# Altium project 701C USB Hub.PrjPCB
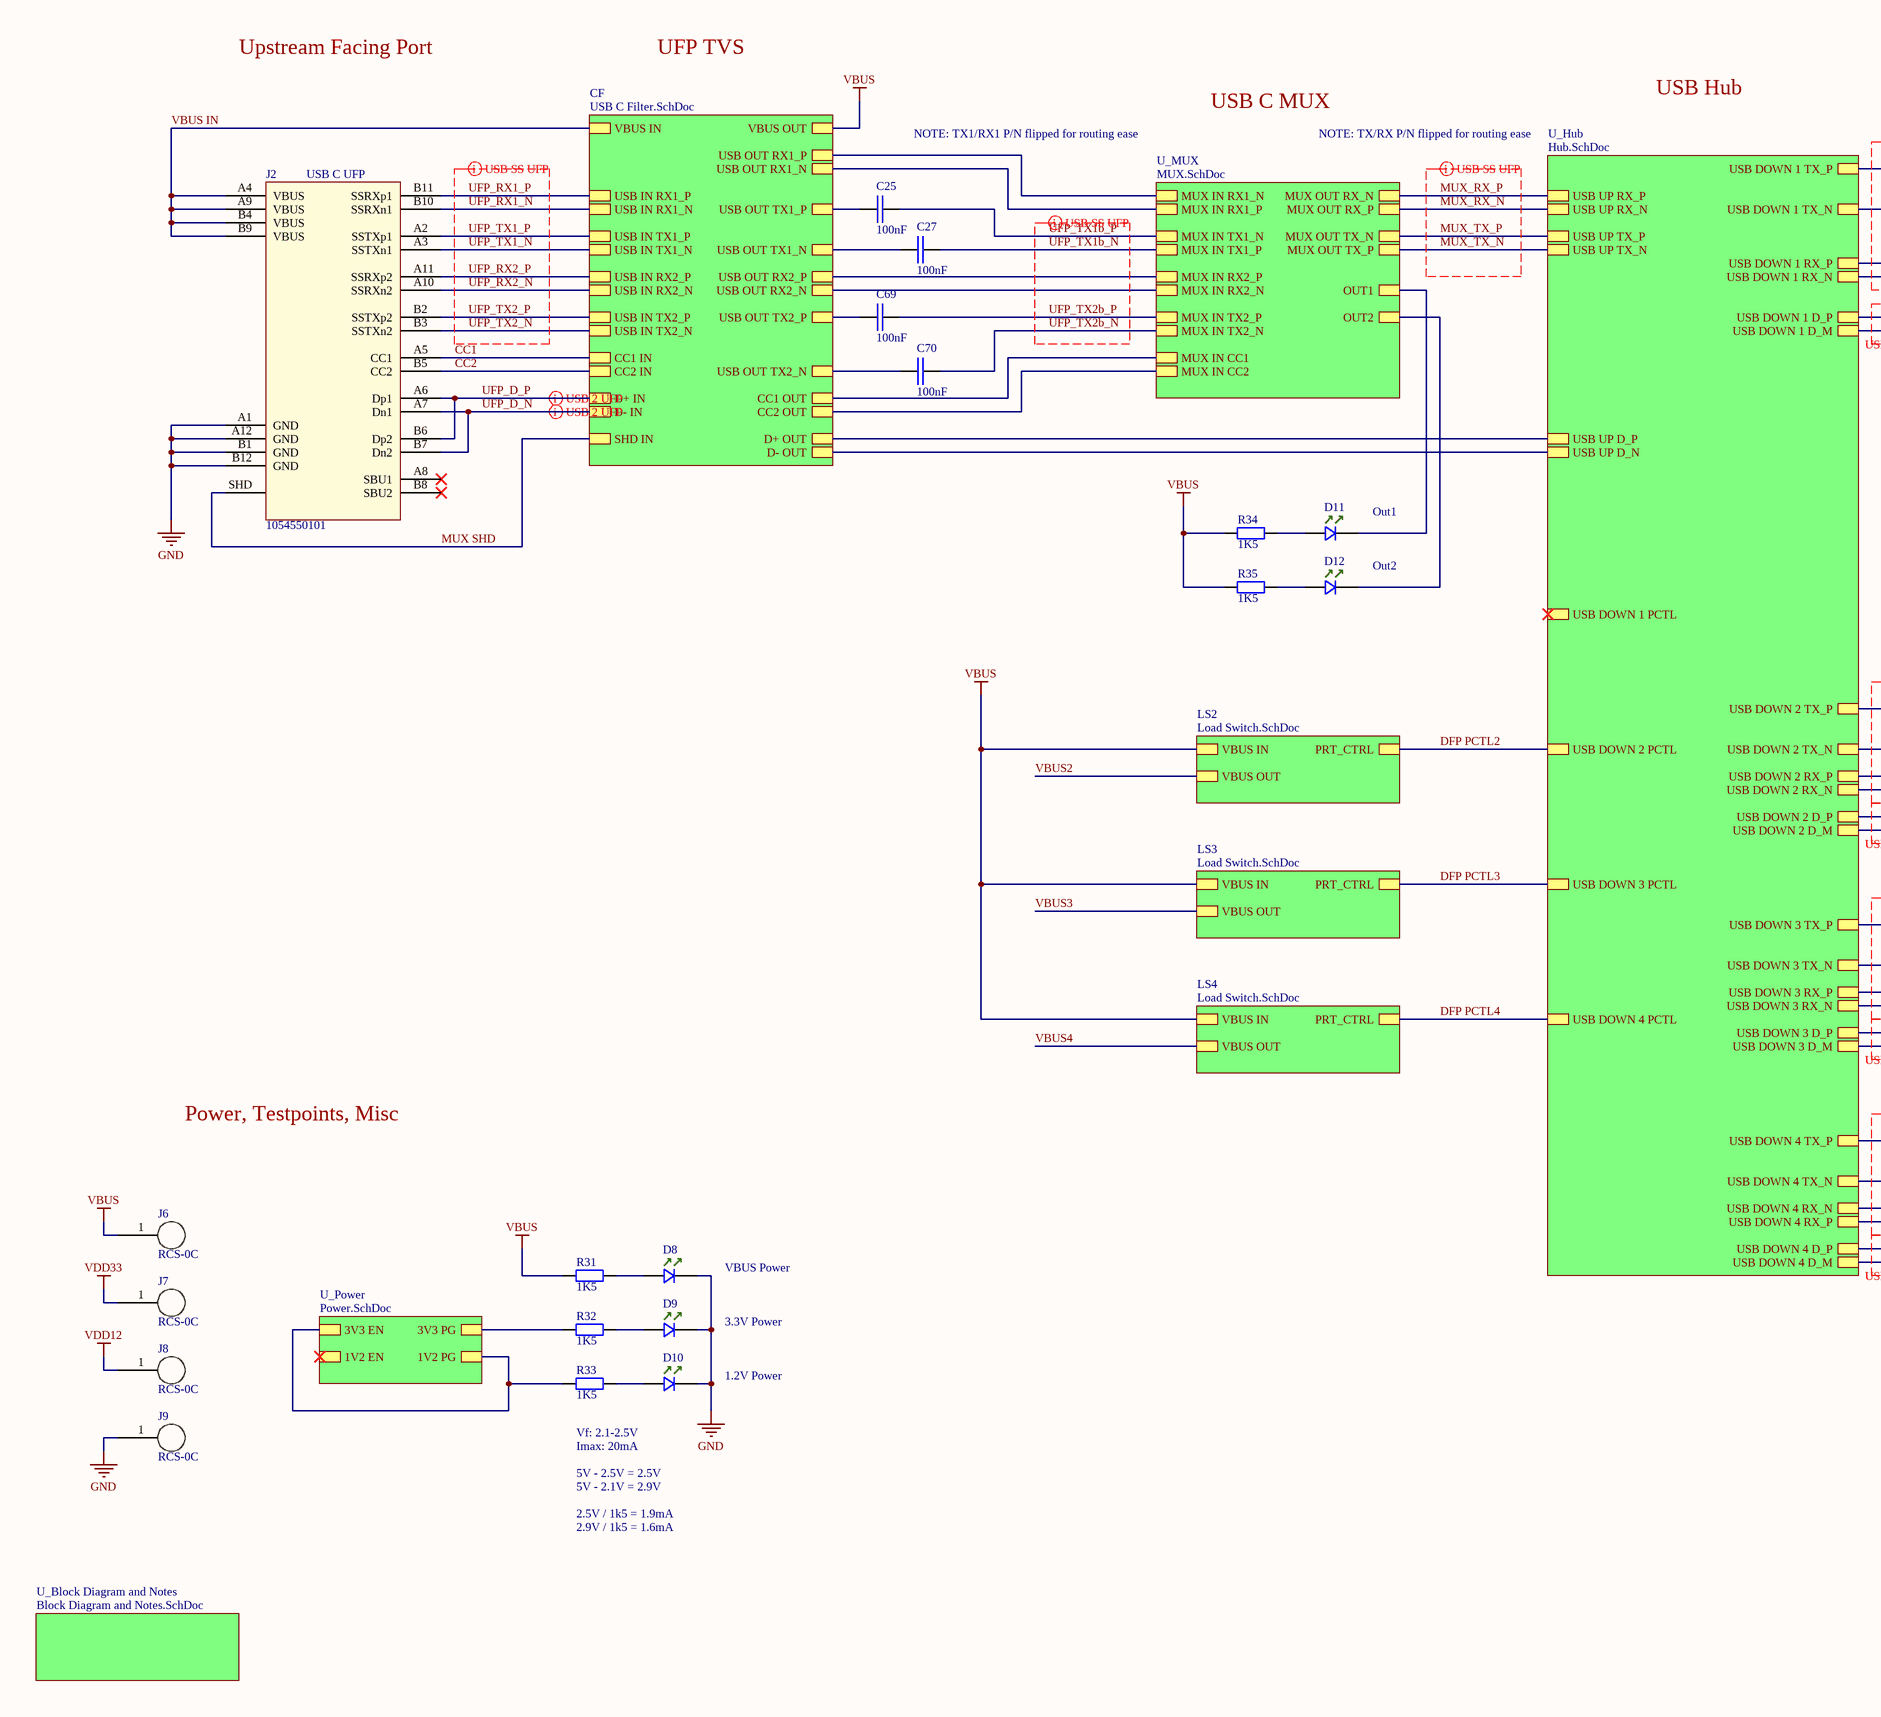
[diagram p0: Top Level.SchDoc, left]
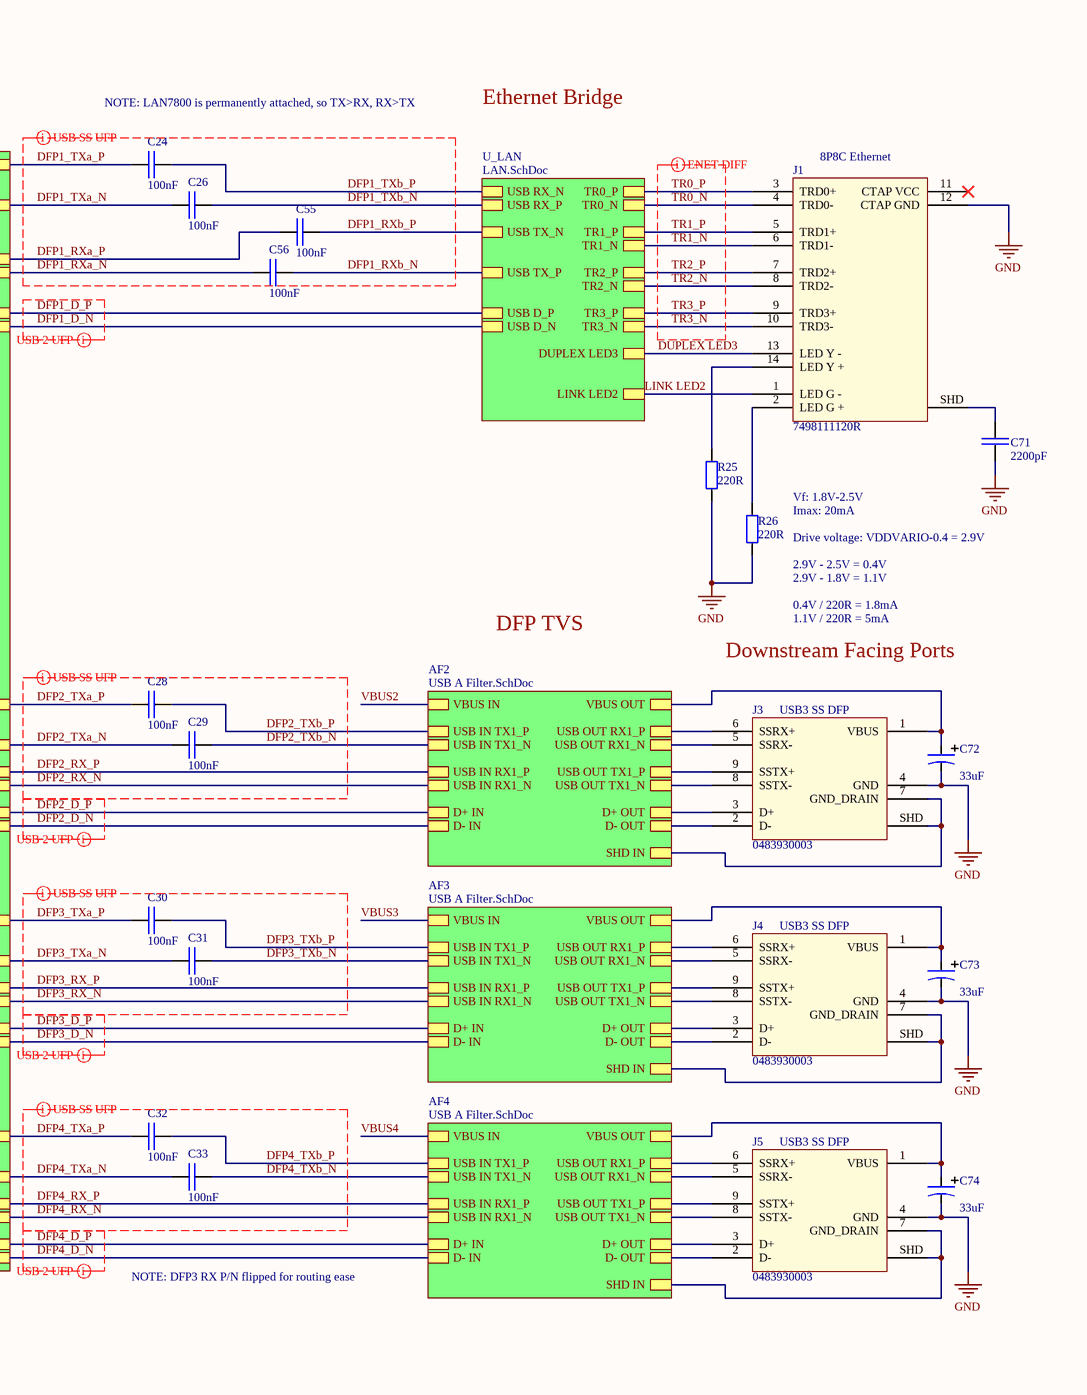
[diagram p1: Top Level.SchDoc, right]
9 sheets, 153 parts. Net scope: hierarchical (ports join the sheet entries above them; power ports are global).
Board file: 701C USB Hub.PcbDoc
Sheets:
  Top Level.SchDoc
    U_Hub = Hub.SchDoc
    U_LAN = LAN.SchDoc
    U_MUX = MUX.SchDoc
    CF = USB C Filter.SchDoc
    AF2 = USB A Filter.SchDoc
    AF3 = USB A Filter.SchDoc
    AF4 = USB A Filter.SchDoc
    LS2 = Load Switch.SchDoc
    LS3 = Load Switch.SchDoc
    LS4 = Load Switch.SchDoc
    U_Block Diagram and Notes = Block Diagram and Notes.SchDoc
    U_Power = Power.SchDoc

## Sheet Top Level.SchDoc
size A2

### Parts
C24  100nF  [CAP_SM0402_YAGEOCA2_N]
C25  100nF  [CAP_SM0402_YAGEOCA2_N]
C26  100nF  [CAP_SM0402_YAGEOCA2_N]
C27  100nF  [CAP_SM0402_YAGEOCA2_N]
C28  100nF  [CAP_SM0402_YAGEOCA2_N]
C29  100nF  [CAP_SM0402_YAGEOCA2_N]
C30  100nF  [CAP_SM0402_YAGEOCA2_N]
C31  100nF  [CAP_SM0402_YAGEOCA2_N]
C32  100nF  [CAP_SM0402_YAGEOCA2_N]
C33  100nF  [CAP_SM0402_YAGEOCA2_N]
C55  100nF  [CAP_SM0402_YAGEOCA2_N]
C56  100nF  [CAP_SM0402_YAGEOCA2_N]
C69  100nF  [CAP_SM0402_YAGEOCA2_N]
C70  100nF  [CAP_SM0402_YAGEOCA2_N]
C71  2200pF  [CAP_SM1206_YAGEOCC2_N]
C72  value 33uF  [CAPAE5543X61M - EEE-FT1E330AR]  (hidden comment: EEE-FT1E330AR)
C73  value 33uF  [CAPAE5543X61M - EEE-FT1E330AR]  (hidden comment: EEE-FT1E330AR)
C74  value 33uF  [CAPAE5543X61M - EEE-FT1E330AR]  (hidden comment: EEE-FT1E330AR)
D8  SML-LXFM0603SUGCTR  [DIOC1608X11N - SML-LXFM0603SUGCTR]  (value not drawn)
D9  SML-LXFM0603SUGCTR  [DIOC1608X11N - SML-LXFM0603SUGCTR]  (value not drawn)
D10  SML-LXFM0603SUGCTR  [DIOC1608X11N - SML-LXFM0603SUGCTR]  (value not drawn)
D11  SML-LXFM0603SUGCTR  [DIOC1608X11N - SML-LXFM0603SUGCTR]  (value not drawn)
D12  SML-LXFM0603SUGCTR  [DIOC1608X11N - SML-LXFM0603SUGCTR]  (value not drawn)
J1  7498111120R  [7498111120R]
J2  1054550101  [1054550101]
J3  0483930003  [0483930003]
J4  0483930003  [0483930003]
J5  0483930003  [0483930003]
J6  RCS-0C  [RCS-0C]
J7  RCS-0C  [RCS-0C]
J8  RCS-0C  [RCS-0C]
J9  RCS-0C  [RCS-0C]
R25  220R  [RES_SM0603_YAGEORC_N]
R26  220R  [RES_SM0603_YAGEORC_N]
R31  1K5  [RES_SM0603_YAGEORC_N]
R32  1K5  [RES_SM0603_YAGEORC_N]
R33  1K5  [RES_SM0603_YAGEORC_N]
R34  1K5  [RES_SM0603_YAGEORC_N]
R35  1K5  [RES_SM0603_YAGEORC_N]

### Sub-sheets
AF2 = USB A Filter.SchDoc: USB IN RX1_P, USB IN RX1_N, USB IN TX1_P, USB IN TX1_N, D+ IN, D- IN, USB OUT RX1_P, USB OUT RX1_N, USB OUT TX1_P, USB OUT TX1_N, D+ OUT, D- OUT, SHD IN, VBUS IN, VBUS OUT
AF3 = USB A Filter.SchDoc: USB IN RX1_P, USB IN RX1_N, USB IN TX1_P, USB IN TX1_N, D+ IN, D- IN, USB OUT RX1_P, USB OUT RX1_N, USB OUT TX1_P, USB OUT TX1_N, D+ OUT, D- OUT, SHD IN, VBUS OUT, VBUS IN
AF4 = USB A Filter.SchDoc: USB IN RX1_P, USB IN RX1_N, USB IN TX1_P, USB IN TX1_N, D+ IN, D- IN, USB OUT RX1_P, USB OUT RX1_N, USB OUT TX1_P, USB OUT TX1_N, D+ OUT, D- OUT, SHD IN, VBUS IN, VBUS OUT
CF = USB C Filter.SchDoc: USB IN RX1_P, USB IN RX1_N, USB IN TX1_P, USB IN TX1_N, USB IN RX2_P, USB IN RX2_N, USB IN TX2_P, USB IN TX2_N, CC1 IN, CC2 IN, D+ IN, D- IN, USB OUT RX1_P, USB OUT RX1_N, USB OUT TX1_P, USB OUT TX1_N, USB OUT RX2_P, USB OUT RX2_N, USB OUT TX2_P, USB OUT TX2_N, CC1 OUT, CC2 OUT, D+ OUT, D- OUT, VBUS IN, VBUS OUT, SHD IN
LS2 = Load Switch.SchDoc: PRT_CTRL, VBUS IN, VBUS OUT
LS3 = Load Switch.SchDoc: PRT_CTRL, VBUS IN, VBUS OUT
LS4 = Load Switch.SchDoc: PRT_CTRL, VBUS IN, VBUS OUT
U_Block Diagram and Notes = Block Diagram and Notes.SchDoc: no entries
U_Hub = Hub.SchDoc: USB UP RX_N, USB UP RX_P, USB UP TX_N, USB UP TX_P, USB UP D_N, USB UP D_P, USB DOWN 1 PCTL, USB DOWN 2 PCTL, USB DOWN 3 PCTL, USB DOWN 4 PCTL, USB DOWN 2 RX_P, USB DOWN 2 RX_N, USB DOWN 2 TX_P, USB DOWN 2 TX_N, USB DOWN 2 D_P, USB DOWN 2 D_M, USB DOWN 3 RX_P, USB DOWN 3 RX_N, USB DOWN 3 TX_P, USB DOWN 3 TX_N, USB DOWN 3 D_P, USB DOWN 3 D_M, USB DOWN 4 D_P, USB DOWN 4 D_M, USB DOWN 4 RX_P, USB DOWN 4 RX_N, USB DOWN 4 TX_P, USB DOWN 4 TX_N, USB DOWN 1 TX_P, USB DOWN 1 TX_N, USB DOWN 1 RX_P, USB DOWN 1 RX_N, USB DOWN 1 D_P, USB DOWN 1 D_M
U_LAN = LAN.SchDoc: USB D_P, USB D_N, USB TX_P, USB TX_N, USB RX_P, USB RX_N, TR0_P, TR0_N, TR1_P, TR1_N, TR2_P, TR2_N, TR3_P, TR3_N, LINK LED2, DUPLEX LED3
U_MUX = MUX.SchDoc: MUX IN RX1_P, MUX IN RX1_N, MUX IN TX1_P, MUX IN TX1_N, MUX IN RX2_P, MUX IN RX2_N, MUX IN TX2_P, MUX IN TX2_N, MUX IN CC1, MUX IN CC2, MUX OUT RX_P, MUX OUT RX_N, MUX OUT TX_P, MUX OUT TX_N, OUT1, OUT2
U_Power = Power.SchDoc: 1V2 PG, 3V3 EN, 1V2 EN, 3V3 PG

### Nets
GND: C71.2 C72.2 C73.2 C74.2 D8.2 D9.2 D10.2 J1.12(CTAP_GND) J2.A1(GND) J2.A12(GND) J2.B1(GND) J2.B12(GND) J3.4(GND) J4.4(GND) J5.4(GND) J9.1 R25.1 R26.1
VBUS: J6.1 R31.1 R34.1 R35.1 ; sheet CF/VBUS OUT, sheet LS2/VBUS IN, sheet LS3/VBUS IN, sheet LS4/VBUS IN
VDD12: J8.1
VDD33: J7.1
CC1: J2.A5(CC1) ; sheet U_MUX/MUX IN CC1, sheet CF/CC1 IN, sheet CF/CC1 OUT
CC2: J2.B5(CC2) ; sheet U_MUX/MUX IN CC2, sheet CF/CC2 IN, sheet CF/CC2 OUT
DFP1_D_N: sheet U_Hub/USB DOWN 1 D_M, sheet U_LAN/USB D_N
DFP1_D_P: sheet U_Hub/USB DOWN 1 D_P, sheet U_LAN/USB D_P
DFP1_RXa_N: C56.1 ; sheet U_Hub/USB DOWN 1 RX_N
DFP1_RXa_P: C55.1 ; sheet U_Hub/USB DOWN 1 RX_P
DFP1_RXb_N: C56.2 ; sheet U_LAN/USB TX_P
DFP1_RXb_P: C55.2 ; sheet U_LAN/USB TX_N
DFP1_TXa_N: C26.1 ; sheet U_Hub/USB DOWN 1 TX_N
DFP1_TXa_P: C24.1 ; sheet U_Hub/USB DOWN 1 TX_P
DFP1_TXb_N: C26.2 ; sheet U_LAN/USB RX_P
DFP1_TXb_P: C24.2 ; sheet U_LAN/USB RX_N
DFP2_D_N: J3.2(D-) ; sheet U_Hub/USB DOWN 2 D_M, sheet AF2/D- IN, sheet AF2/D- OUT
DFP2_D_P: J3.3(D+) ; sheet U_Hub/USB DOWN 2 D_P, sheet AF2/D+ IN, sheet AF2/D+ OUT
DFP2_RX_N: J3.5(SSRX-) ; sheet U_Hub/USB DOWN 2 RX_N, sheet AF2/USB IN RX1_N, sheet AF2/USB OUT RX1_N
DFP2_RX_P: J3.6(SSRX+) ; sheet U_Hub/USB DOWN 2 RX_P, sheet AF2/USB IN RX1_P, sheet AF2/USB OUT RX1_P
DFP2_TXa_N: C29.1 ; sheet U_Hub/USB DOWN 2 TX_N
DFP2_TXa_P: C28.1 ; sheet U_Hub/USB DOWN 2 TX_P
DFP2_TXb_N: C29.2 J3.8(SSTX-) ; sheet AF2/USB IN TX1_N, sheet AF2/USB OUT TX1_N
DFP2_TXb_P: C28.2 J3.9(SSTX+) ; sheet AF2/USB IN TX1_P, sheet AF2/USB OUT TX1_P
DFP3_D_N: J4.2(D-) ; sheet U_Hub/USB DOWN 3 D_M, sheet AF3/D- IN, sheet AF3/D- OUT
DFP3_D_P: J4.3(D+) ; sheet U_Hub/USB DOWN 3 D_P, sheet AF3/D+ IN, sheet AF3/D+ OUT
DFP3_RX_N: J4.5(SSRX-) ; sheet U_Hub/USB DOWN 3 RX_N, sheet AF3/USB IN RX1_N, sheet AF3/USB OUT RX1_N
DFP3_RX_P: J4.6(SSRX+) ; sheet U_Hub/USB DOWN 3 RX_P, sheet AF3/USB IN RX1_P, sheet AF3/USB OUT RX1_P
DFP3_TXa_N: C31.1 ; sheet U_Hub/USB DOWN 3 TX_N
DFP3_TXa_P: C30.1 ; sheet U_Hub/USB DOWN 3 TX_P
DFP3_TXb_N: C31.2 J4.8(SSTX-) ; sheet AF3/USB IN TX1_N, sheet AF3/USB OUT TX1_N
DFP3_TXb_P: C30.2 J4.9(SSTX+) ; sheet AF3/USB IN TX1_P, sheet AF3/USB OUT TX1_P
DFP4_D_N: J5.2(D-) ; sheet U_Hub/USB DOWN 4 D_M, sheet AF4/D- IN, sheet AF4/D- OUT
DFP4_D_P: J5.3(D+) ; sheet U_Hub/USB DOWN 4 D_P, sheet AF4/D+ IN, sheet AF4/D+ OUT
DFP4_RX_N: J5.5(SSRX-) ; sheet U_Hub/USB DOWN 4 RX_P, sheet AF4/USB IN RX1_N, sheet AF4/USB OUT RX1_N
DFP4_RX_P: J5.6(SSRX+) ; sheet U_Hub/USB DOWN 4 RX_N, sheet AF4/USB IN RX1_P, sheet AF4/USB OUT RX1_P
DFP4_TXa_N: C33.1 ; sheet U_Hub/USB DOWN 4 TX_N
DFP4_TXa_P: C32.1 ; sheet U_Hub/USB DOWN 4 TX_P
DFP4_TXb_N: C33.2 J5.8(SSTX-) ; sheet AF4/USB IN TX1_N, sheet AF4/USB OUT TX1_N
DFP4_TXb_P: C32.2 J5.9(SSTX+) ; sheet AF4/USB IN TX1_P, sheet AF4/USB OUT TX1_P
DFP PCTL2: sheet U_Hub/USB DOWN 2 PCTL, sheet LS2/PRT_CTRL
DFP PCTL3: sheet U_Hub/USB DOWN 3 PCTL, sheet LS3/PRT_CTRL
DFP PCTL4: sheet U_Hub/USB DOWN 4 PCTL, sheet LS4/PRT_CTRL
DUPLEX LED3: J1.13(LED_Y_-) ; sheet U_LAN/DUPLEX LED3
LINK LED2: J1.1(LED_G_-) ; sheet U_LAN/LINK LED2
MUX SHD: J2.SHD(B13) ; sheet CF/SHD IN
MUX_RX_N: sheet U_Hub/USB UP RX_N, sheet U_MUX/MUX OUT RX_P
MUX_RX_P: sheet U_Hub/USB UP RX_P, sheet U_MUX/MUX OUT RX_N
MUX_TX_N: sheet U_Hub/USB UP TX_N, sheet U_MUX/MUX OUT TX_P
MUX_TX_P: sheet U_Hub/USB UP TX_P, sheet U_MUX/MUX OUT TX_N
TR0_N: J1.4(TRD0-) ; sheet U_LAN/TR0_N
TR0_P: J1.3(TRD0+) ; sheet U_LAN/TR0_P
TR1_N: J1.6(TRD1-) ; sheet U_LAN/TR1_N
TR1_P: J1.5(TRD1+) ; sheet U_LAN/TR1_P
TR2_N: J1.8(TRD2-) ; sheet U_LAN/TR2_N
TR2_P: J1.7(TRD2+) ; sheet U_LAN/TR2_P
TR3_N: J1.10(TRD3-) ; sheet U_LAN/TR3_N
TR3_P: J1.9(TRD3+) ; sheet U_LAN/TR3_P
UFP_D_N: J2.A7(Dn1) J2.B7(Dn2) ; sheet U_Hub/USB UP D_N, sheet CF/D- IN, sheet CF/D- OUT
UFP_D_P: J2.A6(Dp1) J2.B6(Dp2) ; sheet U_Hub/USB UP D_P, sheet CF/D+ IN, sheet CF/D+ OUT
UFP_RX1_N: J2.B10(SSRXn1) ; sheet U_MUX/MUX IN RX1_P, sheet CF/USB IN RX1_N, sheet CF/USB OUT RX1_N
UFP_RX1_P: J2.B11(SSRXp1) ; sheet U_MUX/MUX IN RX1_N, sheet CF/USB IN RX1_P, sheet CF/USB OUT RX1_P
UFP_RX2_N: J2.A10(SSRXn2) ; sheet U_MUX/MUX IN RX2_N, sheet CF/USB IN RX2_N, sheet CF/USB OUT RX2_N
UFP_RX2_P: J2.A11(SSRXp2) ; sheet U_MUX/MUX IN RX2_P, sheet CF/USB IN RX2_P, sheet CF/USB OUT RX2_P
UFP_TX1_N: C27.1 J2.A3(SSTXn1) ; sheet CF/USB IN TX1_N, sheet CF/USB OUT TX1_N
UFP_TX1_P: C25.1 J2.A2(SSTXp1) ; sheet CF/USB IN TX1_P, sheet CF/USB OUT TX1_P
UFP_TX1b_N: C27.2 ; sheet U_MUX/MUX IN TX1_P
UFP_TX1b_P: C25.2 ; sheet U_MUX/MUX IN TX1_N
UFP_TX2_N: C70.1 J2.B3(SSTXn2) ; sheet CF/USB IN TX2_N, sheet CF/USB OUT TX2_N
UFP_TX2_P: C69.1 J2.B2(SSTXp2) ; sheet CF/USB IN TX2_P, sheet CF/USB OUT TX2_P
UFP_TX2b_N: C70.2 ; sheet U_MUX/MUX IN TX2_N
UFP_TX2b_P: C69.2 ; sheet U_MUX/MUX IN TX2_P
VBUS2: C72.1 J3.1(VBUS) ; sheet AF2/VBUS IN, sheet AF2/VBUS OUT, sheet LS2/VBUS OUT
VBUS3: C73.1 J4.1(VBUS) ; sheet AF3/VBUS OUT, sheet AF3/VBUS IN, sheet LS3/VBUS OUT
VBUS4: C74.1 J5.1(VBUS) ; sheet AF4/VBUS IN, sheet AF4/VBUS OUT, sheet LS4/VBUS OUT
VBUS IN: J2.A4(VBUS) J2.A9(VBUS) J2.B4(VBUS) J2.B9(VBUS) ; sheet CF/VBUS IN
NetC57_AF2_1: J3.7(GND_DRAIN) J3.SHD(B13) ; sheet AF2/SHD IN
NetC57_AF3_1: J4.7(GND_DRAIN) J4.SHD(B13) ; sheet AF3/SHD IN
NetC57_AF4_1: J5.7(GND_DRAIN) J5.SHD(B13) ; sheet AF4/SHD IN
NetC71_1: C71.1 J1.SHD
NetD8_1: D8.1 R31.2
NetD9_1: D9.1 R32.2
NetD10_1: D10.1 R33.2
NetD11_1: D11.1 R34.2
NetD11_2: D11.2 ; sheet U_MUX/OUT1
NetD12_1: D12.1 R35.2
NetD12_2: D12.2 ; sheet U_MUX/OUT2
NetJ1_2: J1.2(LED_G_+) R26.2
NetJ1_14: J1.14(LED_Y_+) R25.2
NetR27_2: R33.1 ; sheet U_Power/1V2 PG, sheet U_Power/3V3 EN
NetR28_2: R32.1 ; sheet U_Power/3V3 PG

Not connected (* = marked no-connect by the designer): J1 11(CTAP_VCC)*; J2 A8(SBU1)* B8(SBU2)*

### Layout directives
differential pair; net class DIFF90SS: DFP1_RXa_N, DFP1_RXa_P, DFP1_RXb_N, DFP1_RXb_P, DFP1_TXa_N, DFP1_TXa_P, DFP1_TXb_N, DFP1_TXb_P, DFP2_RX_N, DFP2_RX_P, DFP2_TXa_N, DFP2_TXa_P, DFP2_TXb_N, DFP2_TXb_P, DFP3_RX_N, DFP3_RX_P, DFP3_TXa_N, DFP3_TXa_P, DFP3_TXb_N, DFP3_TXb_P, DFP4_RX_N, DFP4_RX_P, DFP4_TXa_N, DFP4_TXa_P, DFP4_TXb_N, DFP4_TXb_P, MUX_RX_N, MUX_RX_P, MUX_TX_N, MUX_TX_P, UFP_RX1_N, UFP_RX1_P, UFP_RX2_N, UFP_RX2_P, UFP_TX1_N, UFP_TX1_P, UFP_TX1b_N, UFP_TX1b_P, UFP_TX2_N, UFP_TX2_P, UFP_TX2b_N, UFP_TX2b_P
differential pair; net class DIFF90HS: DFP1_D_N, DFP1_D_P, DFP2_D_N, DFP2_D_P, DFP3_D_N, DFP3_D_P, DFP4_D_N, DFP4_D_P, UFP_D_N, UFP_D_P
differential pair; net class DIFF100: TR0_N, TR0_P, TR1_N, TR1_P, TR2_N, TR2_P, TR3_N, TR3_P

### Notes on the sheet
- Upstream Facing Port
- UFP TVS
- NOTE: TX1/RX1 P/N flipped for routing ease
- USB C MUX
- NOTE: TX/RX P/N flipped for routing ease
- USB Hub
- NOTE: LAN7800 is permanently attached, so TX>RX, RX>TX
- Ethernet Bridge
- (near J2) USB C UFP
- (near J1) 8P8C Ethernet
- (near D11) Out1
- Out2
- Vf: 1.8V-2.5V
  Imax: 20mA
  Drive voltage: VDDVARIO-0.4 = 2.9V
  2.9V - 2.5V = 0.4V
  2.9V - 1.8V = 1.1V
  0.4V / 220R = 1.8mA
  1.1V / 220R = 5mA
- DFP TVS
- Downstream Facing Ports
- (near J3) USB3 SS DFP
- (near J4) USB3 SS DFP
- Power, Testpoints, Misc
- (near J5) USB3 SS DFP
- VBUS Power
- NOTE: DFP3 RX P/N flipped for routing ease
- 3.3V Power
- 1.2V Power
- Vf: 2.1-2.5V
  Imax: 20mA
  5V - 2.5V = 2.5V
  5V - 2.1V = 2.9V
  2.5V / 1k5 = 1.9mA
  2.9V / 1k5 = 1.6mA

### Library data of the parts
C24-C33 C55 C56 C69 C70 = CC0402KRX7R9BB104: CAP 100nF SM0805 X7R 50V YAGEO CC2; Tolerance (%): 10; Voltage Rating (Volts): 50; Category: Capacitor; Manufacturer: Yageo; Manufacturer Part Number: CC0402KRX7R9BB104; Package: 0402; Value: 100nF; ComponentLink1URL: http://www.yageo.com; ComponentLink1Description: Manufacturer Website; Supplier 2: Digi-Key; Supplier Part Number 2: 311-3566-1-ND
C71 = CC1206KKX7RCBB222: CAP 2200pF SM1206 X7R 1000V YAGEO CC2; Tolerance (%): 10; Voltage Rating (Volts): 1000; Category: Capacitor; Manufacturer: Yageo; Manufacturer Part Number: CC1206KKX7RCBB222; Package: 1206; Value: 2200pF; ComponentLink1URL: http://www.yageo.com; ComponentLink1Description: Manufacturer Website; Supplier 2: Farnell; Supplier Part Number 2: 1284147RL
C72-C74 = EEE-FT1E330AR: CAP ALUM 33UF 20% 25V SMD
D8-D12 = SML-LXFM0603SUGCTR: LED GREEN CLEAR SMD
J1 = 7498111120R: CONN JACK 1PORT 1000 BASE-T SMD
J2 = 1054550101: CONN RCP USB3.1 TYPEC 24P SMD RA
J3-J5 = 0483930003: CONN RCPT USB3.0 TYPEA 9POS R/A
R25 R26 = RC0603FR-07220RL: RES 220R SM0603 YAGEO RC_L; Power (Watts): 0.1; Resistance (Ohms): 220; Tolerance (%): 1; Category: Resistor; Manufacturer: Yageo; Manufacturer Part Number: RC0603FR-07220RL; Package: 0603; Value: 220R; Supplier Part Number 1: 2421863; Supplier 1: Farnell; ComponentLink1URL: http://www.yageo.com; ComponentLink1Description: Manufacturer Website; Supplier 2: Digi-Key; Supplier Part Number 2: 311-220HRCT-ND
R31-R35 = RC0603FR-071K5L: RES 1K5 SM0603 YAGEO RC_L; Power (Watts): 0.1; Resistance (Ohms): 1500; Tolerance (%): 1; Category: Resistor; Manufacturer: Yageo; Manufacturer Part Number: RC0603FR-071K5L; Package: 0603; Value: 1K5; Supplier Part Number 1: 9238506; Supplier 1: Farnell; ComponentLink1URL: http://www.yageo.com; ComponentLink1Description: Manufacturer Website; Supplier 2: Digi-Key; Supplier Part Number 2: 311-1.50KHRCT-ND

## Sheet Hub.SchDoc
size B
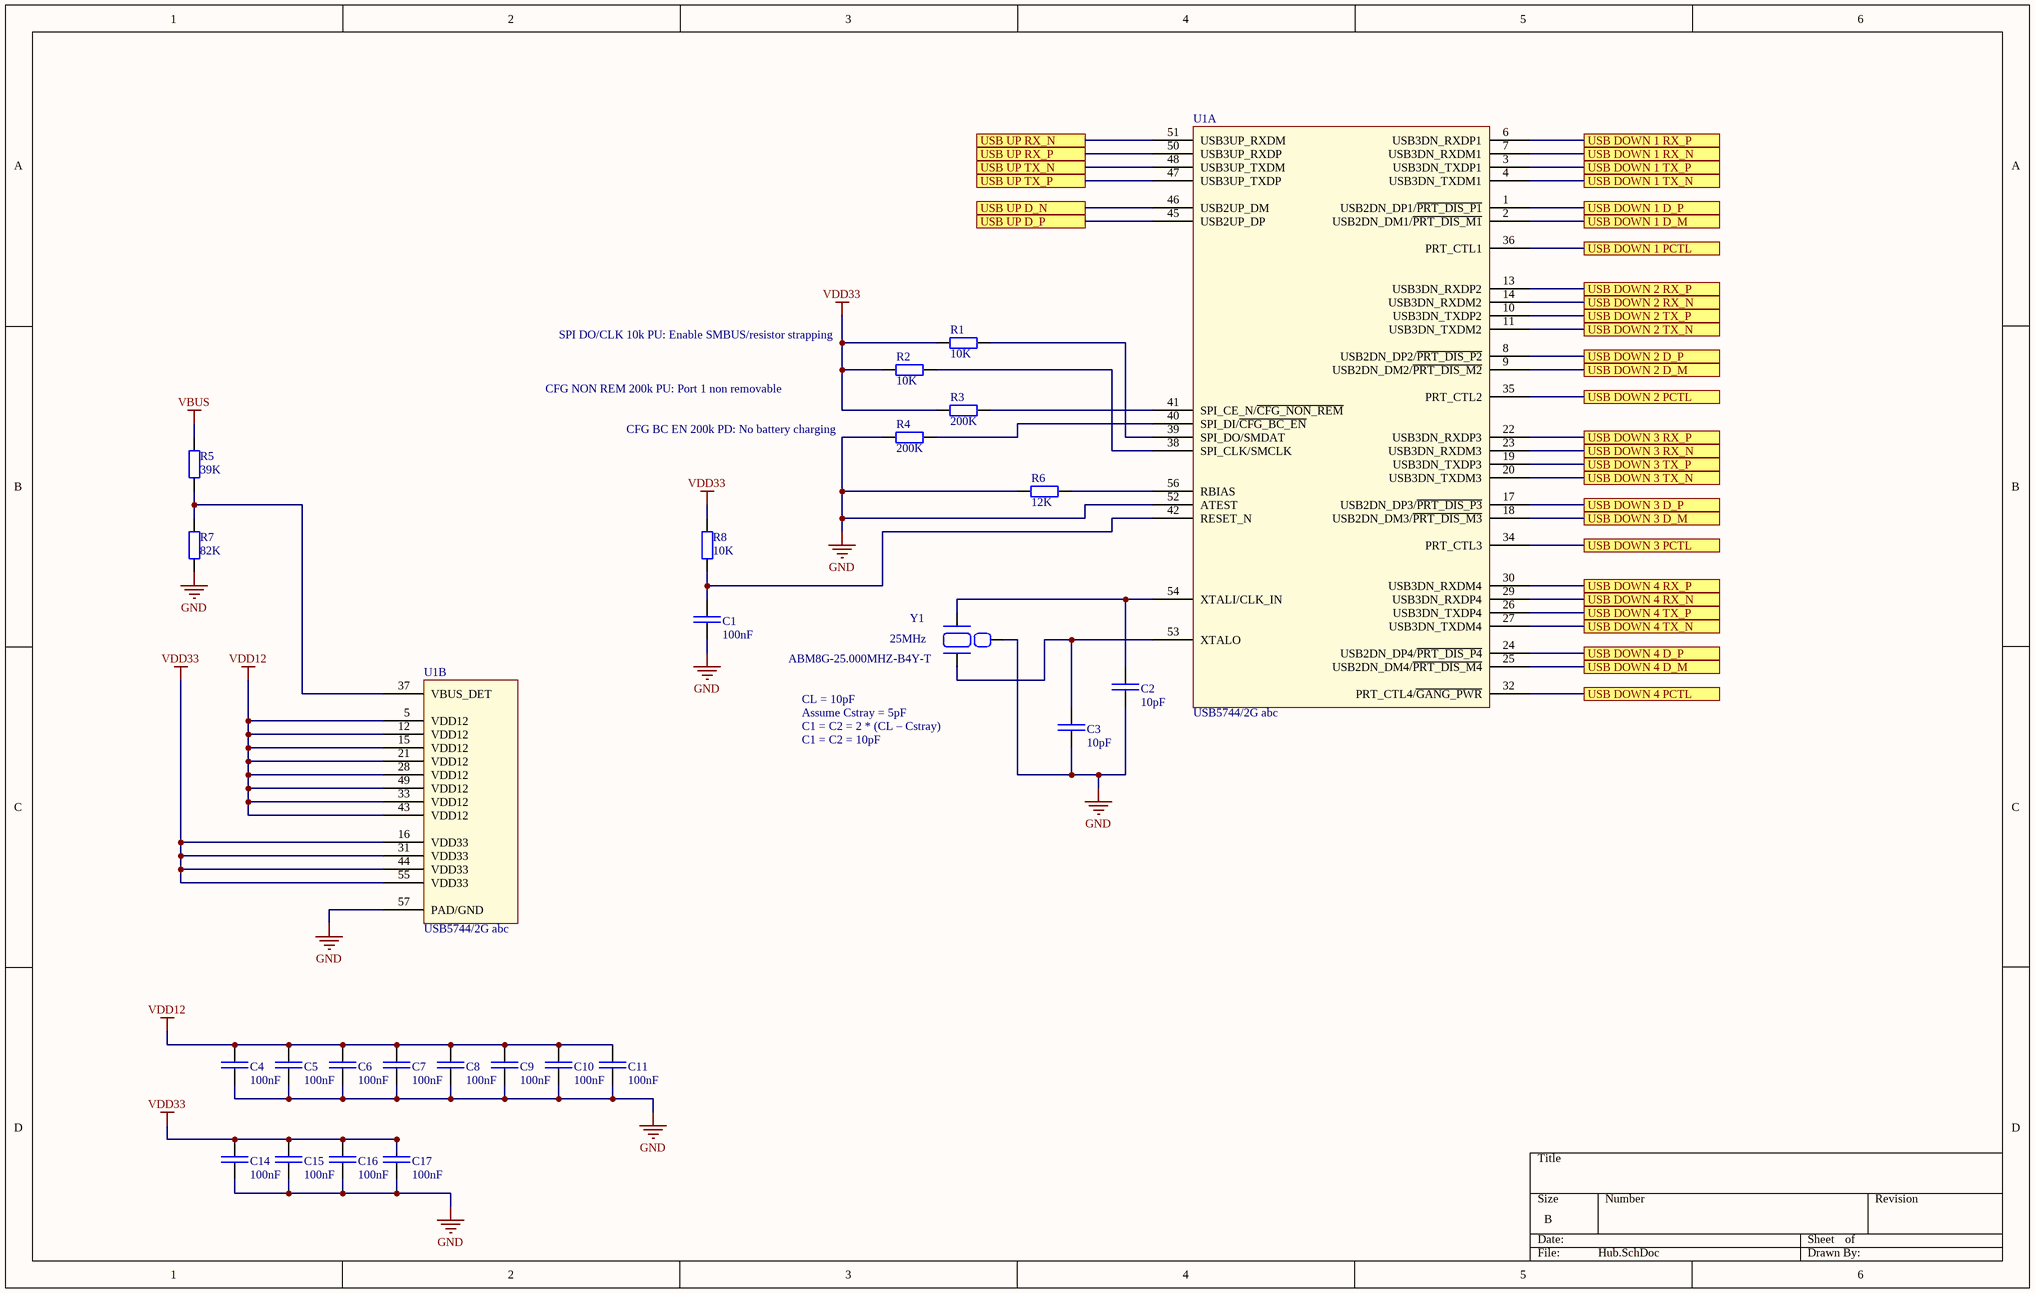
[diagram p2: Hub.SchDoc]

### Parts
C1  100nF  [CAP_SM0603_YAGEOCC2_N]
C2  10pF  [CAP_SM0603_YAGEOCC2_N]
C3  10pF  [CAP_SM0603_YAGEOCC2_N]
C4  100nF  [CAP_SM0603_YAGEOCC2_N]
C5  100nF  [CAP_SM0603_YAGEOCC2_N]
C6  100nF  [CAP_SM0603_YAGEOCC2_N]
C7  100nF  [CAP_SM0603_YAGEOCC2_N]
C8  100nF  [CAP_SM0603_YAGEOCC2_N]
C9  100nF  [CAP_SM0603_YAGEOCC2_N]
C10  100nF  [CAP_SM0603_YAGEOCC2_N]
C11  100nF  [CAP_SM0603_YAGEOCC2_N]
C14  100nF  [CAP_SM0603_YAGEOCC2_N]
C15  100nF  [CAP_SM0603_YAGEOCC2_N]
C16  100nF  [CAP_SM0603_YAGEOCC2_N]
C17  100nF  [CAP_SM0603_YAGEOCC2_N]
R1  10K  [RES_SM0603_YAGEORC_N]
R2  10K  [RES_SM0603_YAGEORC_N]
R3  200K  [RES_SM0603_YAGEORC_N]
R4  200K  [RES_SM0603_YAGEORC_N]
R5  39K  [RES_SM0603_YAGEORC_N]
R6  12K  [RES_SM0603_YAGEORC_N]
R7  82K  [RES_SM0603_YAGEORC_N]
R8  10K  [RES_SM0603_YAGEORC_N]
U1  USB5744/2G abc  [QFN40P700X700X100_HS-57N - USB5744/2G]  (parts A,B of 2)
Y1  ABM8G-25.000MHZ-B4Y-T  [ABM8G-25.000MHZ-B4Y-T]

### Ports
USB DOWN 1 D_M, USB DOWN 1 D_P, USB DOWN 1 PCTL, USB DOWN 1 RX_N, USB DOWN 1 RX_P, USB DOWN 1 TX_N, USB DOWN 1 TX_P, USB DOWN 2 D_M, USB DOWN 2 D_P, USB DOWN 2 PCTL, USB DOWN 2 RX_N, USB DOWN 2 RX_P, USB DOWN 2 TX_N, USB DOWN 2 TX_P, USB DOWN 3 D_M, USB DOWN 3 D_P, USB DOWN 3 PCTL, USB DOWN 3 RX_N, USB DOWN 3 RX_P, USB DOWN 3 TX_N, USB DOWN 3 TX_P, USB DOWN 4 D_M, USB DOWN 4 D_P, USB DOWN 4 PCTL, USB DOWN 4 RX_N, USB DOWN 4 RX_P, USB DOWN 4 TX_N, USB DOWN 4 TX_P, USB UP D_N, USB UP D_P, USB UP RX_N, USB UP RX_P, USB UP TX_N, USB UP TX_P

### Nets
GND: C1.2 C2.1 C3.1 C4.2 C5.2 C6.2 C7.2 C8.2 C9.2 C10.2 C11.2 C14.2 C15.2 C16.2 C17.2 R4.1 R6.1 R7.1 U1.52(ATEST) U1.57(PAD/GND) Y1.GND
VBUS: R5.2
VDD12: C4.1 C5.1 C6.1 C7.1 C8.1 C9.1 C10.1 C11.1 U1.5(VDD12) U1.12(VDD12) U1.15(VDD12) U1.21(VDD12) U1.28(VDD12) U1.33(VDD12) U1.43(VDD12) U1.49(VDD12)
VDD33: C14.1 C15.1 C16.1 C17.1 R1.1 R2.1 R3.1 R8.2 U1.16(VDD33) U1.31(VDD33) U1.44(VDD33) U1.55(VDD33)
DFP1_D_N: U1.2(USB2DN_DM1/~{PRT_DIS_M1}) ; port USB DOWN 1 D_M
DFP1_D_P: U1.1(USB2DN_DP1/~{PRT_DIS_P1}) ; port USB DOWN 1 D_P
DFP1_RXa_N: U1.7(USB3DN_RXDM1) ; port USB DOWN 1 RX_N
DFP1_RXa_P: U1.6(USB3DN_RXDP1) ; port USB DOWN 1 RX_P
DFP1_TXa_N: U1.4(USB3DN_TXDM1) ; port USB DOWN 1 TX_N
DFP1_TXa_P: U1.3(USB3DN_TXDP1) ; port USB DOWN 1 TX_P
DFP2_D_N: U1.9(USB2DN_DM2/~{PRT_DIS_M2}) ; port USB DOWN 2 D_M
DFP2_D_P: U1.8(USB2DN_DP2/~{PRT_DIS_P2}) ; port USB DOWN 2 D_P
DFP2_RX_N: U1.14(USB3DN_RXDM2) ; port USB DOWN 2 RX_N
DFP2_RX_P: U1.13(USB3DN_RXDP2) ; port USB DOWN 2 RX_P
DFP2_TXa_N: U1.11(USB3DN_TXDM2) ; port USB DOWN 2 TX_N
DFP2_TXa_P: U1.10(USB3DN_TXDP2) ; port USB DOWN 2 TX_P
DFP3_D_N: U1.18(USB2DN_DM3/~{PRT_DIS_M3}) ; port USB DOWN 3 D_M
DFP3_D_P: U1.17(USB2DN_DP3/~{PRT_DIS_P3}) ; port USB DOWN 3 D_P
DFP3_RX_N: U1.23(USB3DN_RXDM3) ; port USB DOWN 3 RX_N
DFP3_RX_P: U1.22(USB3DN_RXDP3) ; port USB DOWN 3 RX_P
DFP3_TXa_N: U1.20(USB3DN_TXDM3) ; port USB DOWN 3 TX_N
DFP3_TXa_P: U1.19(USB3DN_TXDP3) ; port USB DOWN 3 TX_P
DFP4_D_N: U1.25(USB2DN_DM4/~{PRT_DIS_M4}) ; port USB DOWN 4 D_M
DFP4_D_P: U1.24(USB2DN_DP4/~{PRT_DIS_P4}) ; port USB DOWN 4 D_P
DFP4_RX_N: U1.30(USB3DN_RXDM4) ; port USB DOWN 4 RX_P
DFP4_RX_P: U1.29(USB3DN_RXDP4) ; port USB DOWN 4 RX_N
DFP4_TXa_N: U1.27(USB3DN_TXDM4) ; port USB DOWN 4 TX_N
DFP4_TXa_P: U1.26(USB3DN_TXDP4) ; port USB DOWN 4 TX_P
DFP PCTL2: U1.35(PRT_CTL2) ; port USB DOWN 2 PCTL
DFP PCTL3: U1.34(PRT_CTL3) ; port USB DOWN 3 PCTL
DFP PCTL4: U1.32(PRT_CTL4/~{GANG_PWR}) ; port USB DOWN 4 PCTL
MUX_RX_N: U1.51(USB3UP_RXDM) ; port USB UP RX_N
MUX_RX_P: U1.50(USB3UP_RXDP) ; port USB UP RX_P
MUX_TX_N: U1.48(USB3UP_TXDM) ; port USB UP TX_N
MUX_TX_P: U1.47(USB3UP_TXDP) ; port USB UP TX_P
UFP_D_N: U1.46(USB2UP_DM) ; port USB UP D_N
UFP_D_P: U1.45(USB2UP_DP) ; port USB UP D_P
NetC1_1: C1.1 R8.1 U1.42(RESET_N)
NetC2_2: C2.2 U1.54(XTALI/CLK_IN) Y1.1
NetC3_2: C3.2 U1.53(XTALO) Y1.3
NetR1_2: R1.2 U1.39(SPI_DO/SMDAT)
NetR2_2: R2.2 U1.38(SPI_CLK/SMCLK)
NetR3_2: R3.2 U1.41(SPI_CE_N/~{CFG_NON_REM})
NetR4_2: R4.2 U1.40(SPI_DI/~{CFG_BC_EN})
NetR5_1: R5.1 R7.2 U1.37(VBUS_DET)
NetR6_2: R6.2 U1.56(RBIAS)
NetU1_36: U1.36(PRT_CTL1) ; port USB DOWN 1 PCTL

### Notes on the sheet
- (near R2) SPI DO/CLK 10k PU: Enable SMBUS/resistor strapping
- CFG NON REM 200k PU: Port 1 non removable
- (near R4) CFG BC EN 200k PD: No battery charging
- CL = 10pF
- C1 = C2 = 2 * (CL – Cstray)
- Assume Cstray = 5pF
- C1 = C2 = 10pF
- (in symbol ABM8G-25.000MHZ-B4Y-T) 25MHz

### Library data of the parts
C1 C4-C11 C14-C17 = CC0603KRX7R9BB104: CAP 100nF SM0603 X7R 50V YAGEO CC2; Tolerance (%): 10; Voltage Rating (Volts): 50; Category: Capacitor; Manufacturer: Yageo; Manufacturer Part Number: CC0603KRX7R9BB104; Package: 0603; Value: 100nF; Supplier Part Number 1: 1362556; Supplier 1: Farnell; ComponentLink1URL: http://www.yageo.com; ComponentLink1Description: Manufacturer Website; Supplier 2: Digi-Key; Supplier Part Number 2: 311-1344-1-ND
C2 C3 = CC0603JRNPO9BN100: CAP 10pF SM0603 NPO 50V YAGEO CC2; Tolerance (%): 5; Voltage Rating (Volts): 50; Category: Capacitor; Manufacturer: Yageo; Manufacturer Part Number: CC0603JRNPO9BN100; Package: 0603; Value: 10pF; Supplier Part Number 1: 721967; Supplier 1: Farnell; ComponentLink1URL: http://www.yageo.com; ComponentLink1Description: Manufacturer Website; Supplier 2: Digi-Key; Supplier Part Number 2: 311-1058-1-ND
R1 R2 R8 = RC0603FR-0710KL: RES 10K SM0603 YAGEO RC_L; Power (Watts): 0.1; Resistance (Ohms): 10000; Tolerance (%): 1; Category: Resistor; Manufacturer: Yageo; Manufacturer Part Number: RC0603FR-0710KL; Package: 0603; Value: 10K; Supplier Part Number 1: 9238603; Supplier 1: Farnell; ComponentLink1URL: http://www.yageo.com; ComponentLink1Description: Manufacturer Website; Supplier 2: Digi-Key; Supplier Part Number 2: 311-10.0KHRCT-ND
R3 R4 = RC0603FR-07200KL: RES 200K SM0603 YAGEO RC_L; Power (Watts): 0.1; Resistance (Ohms): 200000; Tolerance (%): 1; Category: Resistor; Manufacturer: Yageo; Manufacturer Part Number: RC0603FR-07200KL; Package: 0603; Value: 200K; ComponentLink1URL: http://www.yageo.com; ComponentLink1Description: Manufacturer Website; Supplier 2: Digi-Key; Supplier Part Number 2: 311-200KHRCT-ND
R5 = RC0603FR-0739KL: RES 39K SM0603 YAGEO RC_L; Power (Watts): 0.1; Resistance (Ohms): 39000; Tolerance (%): 1; Category: Resistor; Manufacturer: Yageo; Manufacturer Part Number: RC0603FR-0739KL; Package: 0603; Value: 39K; Supplier Part Number 1: 9238670; Supplier 1: Farnell; ComponentLink1URL: http://www.yageo.com; ComponentLink1Description: Manufacturer Website; Supplier 2: Digi-Key; Supplier Part Number 2: 311-39.0KHRCT-ND
R6 = RC0603FR-0712KL: RES 12K SM0603 YAGEO RC_L; Power (Watts): 0.1; Resistance (Ohms): 12000; Tolerance (%): 1; Category: Resistor; Manufacturer: Yageo; Manufacturer Part Number: RC0603FR-0712KL; Package: 0603; Value: 12K; Supplier Part Number 1: 9238611; Supplier 1: Farnell; ComponentLink1URL: http://www.yageo.com; ComponentLink1Description: Manufacturer Website; Supplier 2: Digi-Key; Supplier Part Number 2: 311-12.0KHRCT-ND
R7 = RC0603FR-0782KL: RES 82K SM0603 YAGEO RC_L; Power (Watts): 0.1; Resistance (Ohms): 82000; Tolerance (%): 1; Category: Resistor; Manufacturer: Yageo; Manufacturer Part Number: RC0603FR-0782KL; Package: 0603; Value: 82K; Supplier Part Number 1: 9238719; Supplier 1: Farnell; ComponentLink1URL: http://www.yageo.com; ComponentLink1Description: Manufacturer Website; Supplier 2: Digi-Key; Supplier Part Number 2: 311-82.0KHRCT-ND
U1 = USB5744/2G abc: IC HUB CTLR USB 56VQFN
Y1 = ABM8G-25.000MHZ-B4Y-T: CRYSTAL 25.0000MHZ 10PF SMD

## Sheet LAN.SchDoc
size B
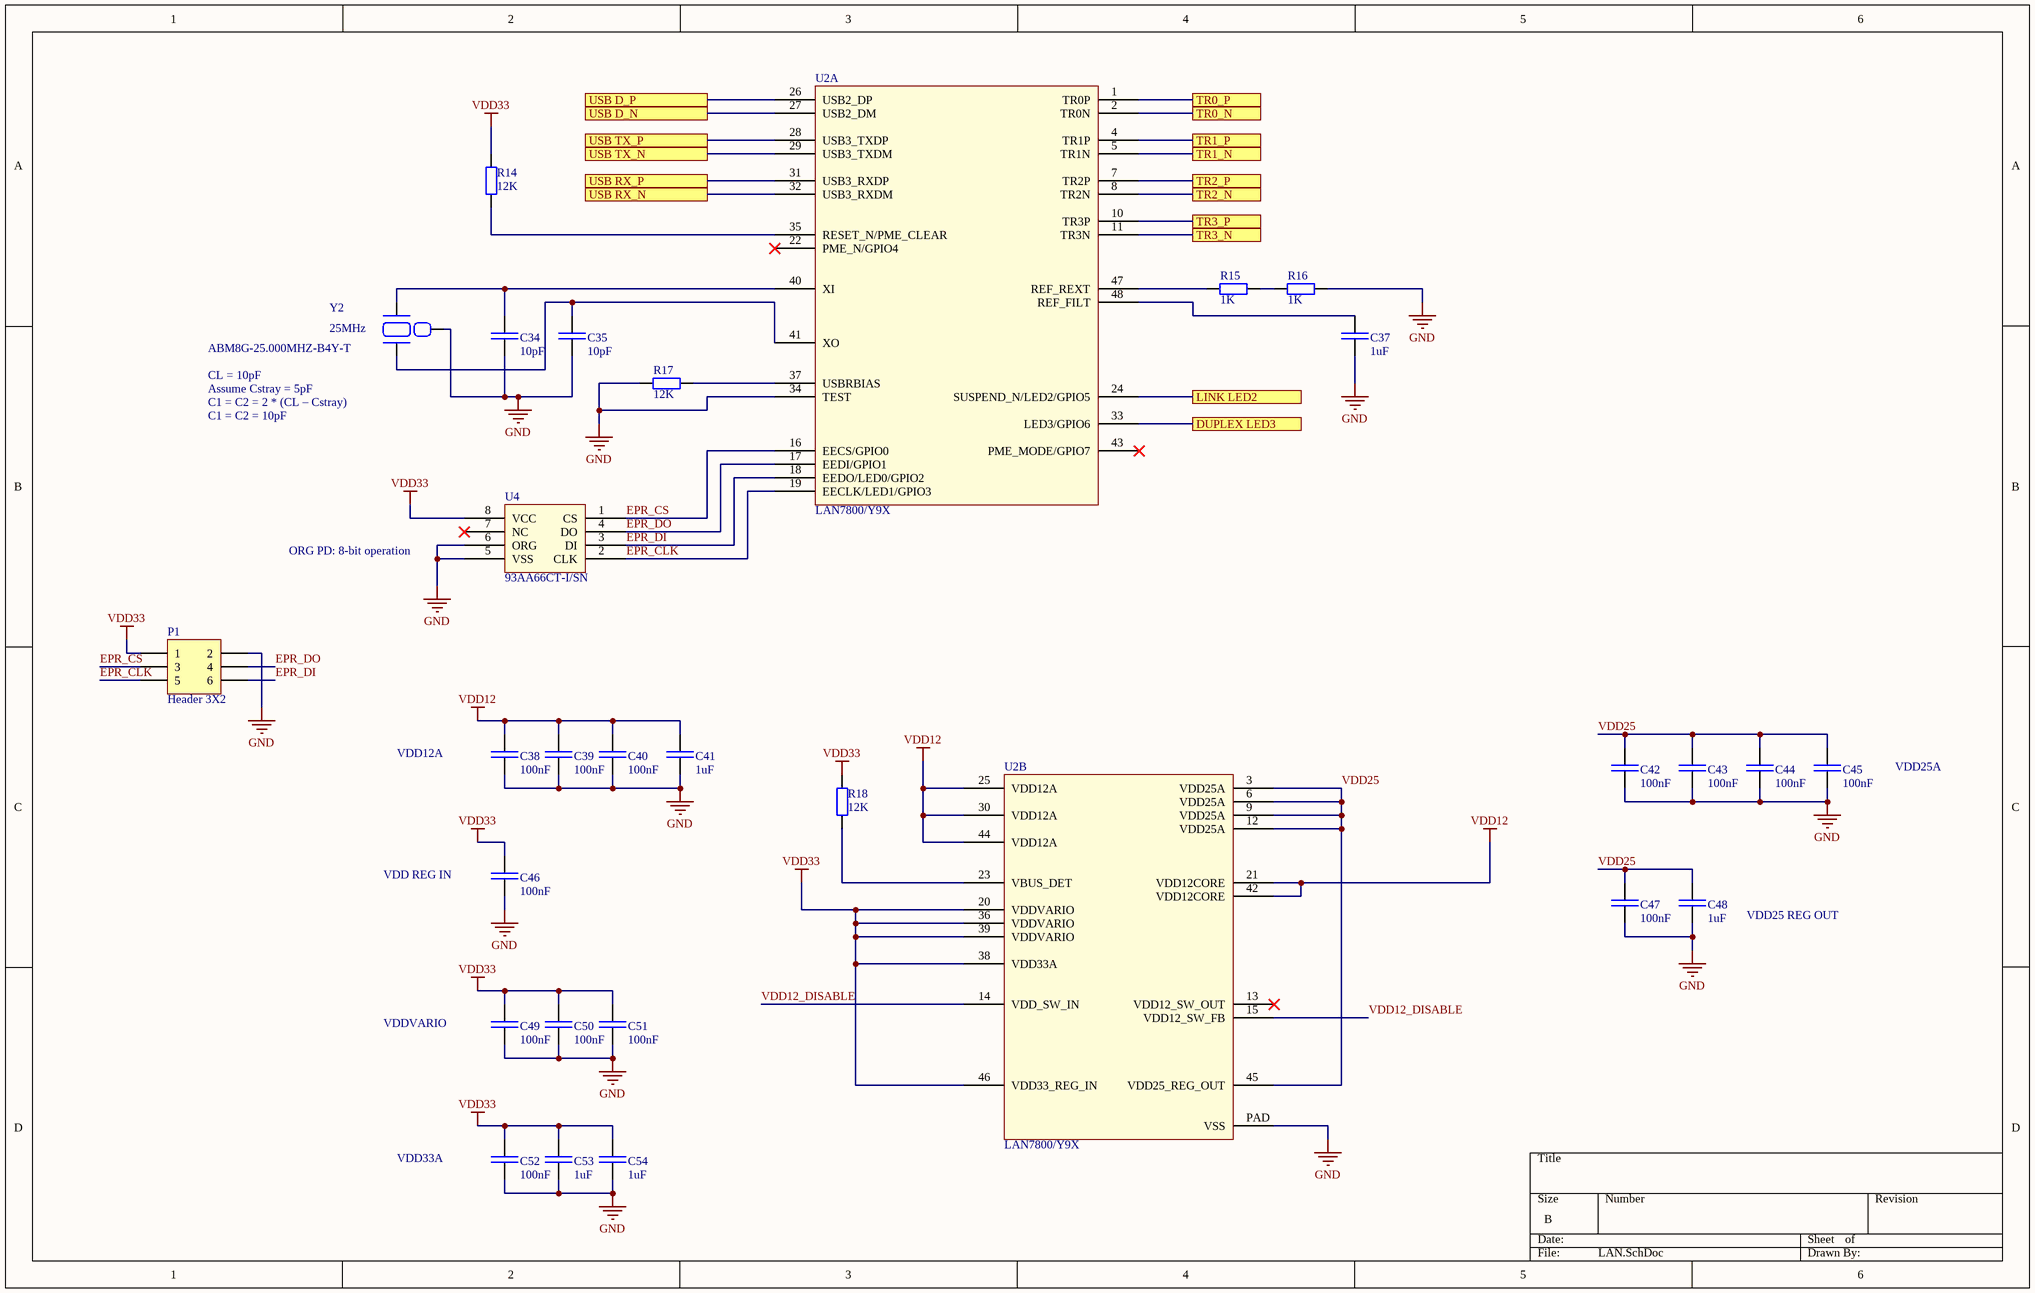
[diagram p3: LAN.SchDoc]

### Parts
C34  10pF  [CAP_SM0603_YAGEOCC2_N]
C35  10pF  [CAP_SM0603_YAGEOCC2_N]
C37  1uF  [CAP_SM0805_YAGEOCC2_N]
C38  100nF  [CAP_SM0603_YAGEOCC2_N]
C39  100nF  [CAP_SM0603_YAGEOCC2_N]
C40  100nF  [CAP_SM0603_YAGEOCC2_N]
C41  1uF  [CAP_SM0805_YAGEOCC2_N]
C42  100nF  [CAP_SM0603_YAGEOCC2_N]
C43  100nF  [CAP_SM0603_YAGEOCC2_N]
C44  100nF  [CAP_SM0603_YAGEOCC2_N]
C45  100nF  [CAP_SM0603_YAGEOCC2_N]
C46  100nF  [CAP_SM0603_YAGEOCC2_N]
C47  100nF  [CAP_SM0603_YAGEOCC2_N]
C48  1uF  [CAP_SM0805_YAGEOCC2_N]
C49  100nF  [CAP_SM0603_YAGEOCC2_N]
C50  100nF  [CAP_SM0603_YAGEOCC2_N]
C51  100nF  [CAP_SM0603_YAGEOCC2_N]
C52  100nF  [CAP_SM0603_YAGEOCC2_N]
C53  1uF  [CAP_SM0805_YAGEOCC2_N]
C54  1uF  [CAP_SM0805_YAGEOCC2_N]
P1  Header 3X2  [HDR2X3]
R14  12K  [RES_SM0603_YAGEORC_N]
R15  1K  [RES_SM0603_YAGEORC_N]
R16  1K  [RES_SM0603_YAGEORC_N]
R17  12K  [RES_SM0603_YAGEORC_N]
R18  12K  [RES_SM0603_YAGEORC_N]
U2  LAN7800/Y9X  [QFN50P700X700X100_HS-49N - LAN7800/Y9X]  (parts A,B of 2)
U4  93AA66CT-I/SN  [SOIC127P600X175-8N - 93AA66CT-I/SN]
Y2  ABM8G-25.000MHZ-B4Y-T  [ABM8G-25.000MHZ-B4Y-T]

### Ports
DUPLEX LED3, LINK LED2, TR0_N, TR0_P, TR1_N, TR1_P, TR2_N, TR2_P, TR3_N, TR3_P, USB D_N, USB D_P, USB RX_N, USB RX_P, USB TX_N, USB TX_P

### Nets
GND: C34.2 C35.2 C37.2 C38.2 C39.2 C40.2 C41.2 C42.2 C43.2 C44.2 C45.2 C46.2 C47.2 C48.2 C49.2 C50.2 C51.2 C52.2 C53.2 C54.2 P1.2 R16.2 R17.1 U2.34(TEST) U2.PAD(VSS) U4.5(VSS) U4.6(ORG) Y2.GND
VDD12: C38.1 C39.1 C40.1 C41.1 U2.21(VDD12CORE) U2.25(VDD12A) U2.30(VDD12A) U2.42(VDD12CORE) U2.44(VDD12A)
VDD33: C46.1 C49.1 C50.1 C51.1 C52.1 C53.1 C54.1 P1.1 R14.2 R18.2 U2.20(VDDVARIO) U2.36(VDDVARIO) U2.38(VDD33A) U2.39(VDDVARIO) U2.46(VDD33_REG_IN) U4.8(VCC)
DFP1_D_N: U2.27(USB2_DM) ; port USB D_N
DFP1_D_P: U2.26(USB2_DP) ; port USB D_P
DFP1_RXb_N: U2.28(USB3_TXDP) ; port USB TX_P
DFP1_RXb_P: U2.29(USB3_TXDM) ; port USB TX_N
DFP1_TXb_N: U2.31(USB3_RXDP) ; port USB RX_P
DFP1_TXb_P: U2.32(USB3_RXDM) ; port USB RX_N
DUPLEX LED3: U2.33(LED3/GPIO6) ; port DUPLEX LED3
EPR_CLK: P1.5 U2.19(EECLK/LED1/GPIO3) U4.2(CLK)
EPR_CS: P1.3 U2.16(EECS/GPIO0) U4.1(CS)
EPR_DI: P1.6 U2.18(EEDO/LED0/GPIO2) U4.3(DI)
EPR_DO: P1.4 U2.17(EEDI/GPIO1) U4.4(DO)
LINK LED2: U2.24(SUSPEND_N/LED2/GPIO5) ; port LINK LED2
TR0_N: U2.2(TR0N) ; port TR0_N
TR0_P: U2.1(TR0P) ; port TR0_P
TR1_N: U2.5(TR1N) ; port TR1_N
TR1_P: U2.4(TR1P) ; port TR1_P
TR2_N: U2.8(TR2N) ; port TR2_N
TR2_P: U2.7(TR2P) ; port TR2_P
TR3_N: U2.11(TR3N) ; port TR3_N
TR3_P: U2.10(TR3P) ; port TR3_P
VDD12_DISABLE: U2.14(VDD_SW_IN) U2.15(VDD12_SW_FB)
VDD25: C42.1 C43.1 C44.1 C45.1 C47.1 C48.1 U2.3(VDD25A) U2.6(VDD25A) U2.9(VDD25A) U2.12(VDD25A) U2.45(VDD25_REG_OUT)
NetC34_1: C34.1 U2.40(XI) Y2.1
NetC35_1: C35.1 U2.41(XO) Y2.3
NetC37_1: C37.1 U2.48(REF_FILT)
NetR14_1: R14.1 U2.35(RESET_N/PME_CLEAR)
NetR15_1: R15.1 U2.47(REF_REXT)
NetR15_2: R15.2 R16.1
NetR17_2: R17.2 U2.37(USBRBIAS)
NetR18_1: R18.1 U2.23(VBUS_DET)

Not connected (* = marked no-connect by the designer): U2 13(VDD12_SW_OUT)* 22(PME_N/GPIO4)* 43(PME_MODE/GPIO7)*; U4 7(NC)*

### Notes on the sheet
- C1 = C2 = 2 * (CL – Cstray)
- CL = 10pF
- Assume Cstray = 5pF
- C1 = C2 = 10pF
- ORG PD: 8-bit operation
- VDD12A
- VDD25A
- VDD REG IN
- VDD25 REG OUT
- VDDVARIO
- VDD33A
- (in symbol ABM8G-25.000MHZ-B4Y-T) 25MHz

### Library data of the parts
C34 C35 = CC0603JRNPO9BN100: as C2 on sheet Hub; Category: Capacitor; Manufacturer: Yageo; Manufacturer Part Number: CC0603JRNPO9BN100; Package: 0603; Value: 10pF; Supplier Part Number 1: 721967; Supplier 1: Farnell; ComponentLink1URL: http://www.yageo.com; ComponentLink1Description: Manufacturer Website; Supplier 2: Digi-Key; Supplier Part Number 2: 311-1058-1-ND
C37 C41 C48 C53 C54 = CC0805KKX7R8BB105: CAP 1uF SM0805 X7R 25V YAGEO CC2; Tolerance (%): 10; Voltage Rating (Volts): 25; Category: Capacitor; Manufacturer: Yageo; Manufacturer Part Number: CC0805KKX7R8BB105; Package: 0805; Value: 1uF; Supplier Part Number 1: 1458903; Supplier 1: Farnell; ComponentLink1URL: http://www.yageo.com; ComponentLink1Description: Manufacturer Website; Supplier 2: Digi-Key; Supplier Part Number 2: 311-1456-1-ND
C38-C40 C42-C47 C49-C52 = CC0603KRX7R9BB104: as C1 on sheet Hub; Category: Capacitor; Manufacturer: Yageo; Manufacturer Part Number: CC0603KRX7R9BB104; Package: 0603; Value: 100nF; Supplier Part Number 1: 1362556; Supplier 1: Farnell; ComponentLink1URL: http://www.yageo.com; ComponentLink1Description: Manufacturer Website; Supplier 2: Digi-Key; Supplier Part Number 2: 311-1344-1-ND
P1 = Header 3X2: Header, 3-Pin, Dual row; LatestRevisionDate: 17-Jul-2002; LatestRevisionNote: Re-released for DXP Platform.; Publisher: Altium Limited
R14 R17 R18 = RC0603FR-0712KL: as R6 on sheet Hub; Category: Resistor; Manufacturer: Yageo; Manufacturer Part Number: RC0603FR-0712KL; Package: 0603; Value: 12K; Supplier Part Number 1: 9238611; Supplier 1: Farnell; ComponentLink1URL: http://www.yageo.com; ComponentLink1Description: Manufacturer Website; Supplier 2: Digi-Key; Supplier Part Number 2: 311-12.0KHRCT-ND
R15 R16 = RC0603FR-071KL: RES 1K SM0603 YAGEO RC_L; Power (Watts): 0.1; Resistance (Ohms): 1000; Tolerance (%): 1; Category: Resistor; Manufacturer: Yageo; Manufacturer Part Number: RC0603FR-071KL; Package: 0603; Value: 1K; Supplier Part Number 1: 9238484; Supplier 1: Farnell; ComponentLink1URL: http://www.yageo.com; ComponentLink1Description: Manufacturer Website; Supplier 2: Digi-Key; Supplier Part Number 2: 311-1.00KHRCT-ND
U2 = LAN7800/Y9X: IC ETHERNET CTLR USB 48SQFN 7x7
U4 = 93AA66CT-I/SN: IC EEPROM 4KBIT MICROWIRE 8SOIC
Y2 = ABM8G-25.000MHZ-B4Y-T: CRYSTAL 25.0000MHZ 10PF SMD

## Sheet MUX.SchDoc
size B
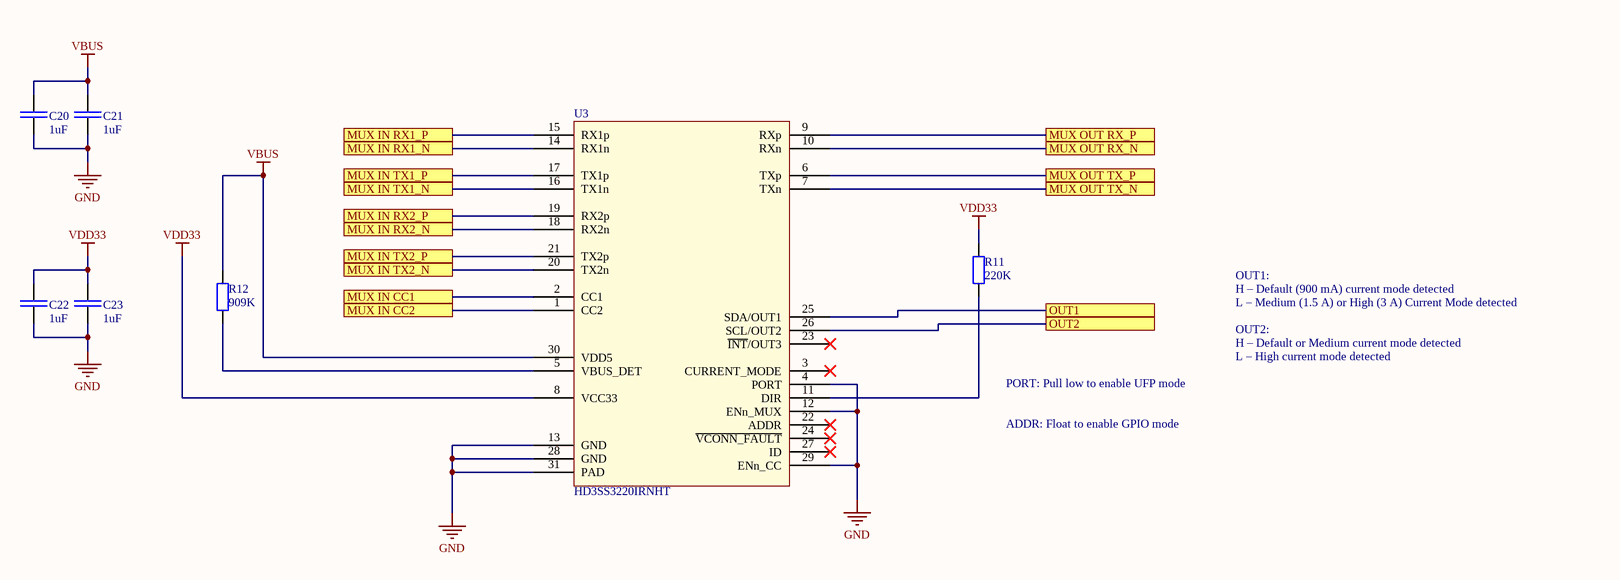
[diagram p4: MUX.SchDoc]

### Parts
C20  1uF  [CAP_SM0805_YAGEOCC2_N]
C21  1uF  [CAP_SM0805_YAGEOCC2_N]
C22  1uF  [CAP_SM0805_YAGEOCC2_N]
C23  1uF  [CAP_SM0805_YAGEOCC2_N]
R11  220K  [RES_SM0603_YAGEORC_N]
R12  909K  [RES_SM0603_YAGEORC_N]
U3  HD3SS3220IRNHT  [QFN40P250X450X80_HS-31N - HD3SS3220IRNHT]

### Ports
MUX IN CC1, MUX IN CC2, MUX IN RX1_N, MUX IN RX1_P, MUX IN RX2_N, MUX IN RX2_P, MUX IN TX1_N, MUX IN TX1_P, MUX IN TX2_N, MUX IN TX2_P, MUX OUT RX_N, MUX OUT RX_P, MUX OUT TX_N, MUX OUT TX_P, OUT1, OUT2

### Nets
GND: C20.2 C21.2 C22.2 C23.2 U3.4(PORT) U3.12(ENn_MUX) U3.13(GND) U3.28(GND) U3.29(ENn_CC) U3.31(PAD)
VBUS: C20.1 C21.1 R12.2 U3.30(VDD5)
VDD33: C22.1 C23.1 R11.2 U3.8(VCC33)
CC1: U3.2(CC1) ; port MUX IN CC1
CC2: U3.1(CC2) ; port MUX IN CC2
MUX_RX_N: U3.9(RXp) ; port MUX OUT RX_P
MUX_RX_P: U3.10(RXn) ; port MUX OUT RX_N
MUX_TX_N: U3.6(TXp) ; port MUX OUT TX_P
MUX_TX_P: U3.7(TXn) ; port MUX OUT TX_N
UFP_RX1_N: U3.15(RX1p) ; port MUX IN RX1_P
UFP_RX1_P: U3.14(RX1n) ; port MUX IN RX1_N
UFP_RX2_N: U3.18(RX2n) ; port MUX IN RX2_N
UFP_RX2_P: U3.19(RX2p) ; port MUX IN RX2_P
UFP_TX1b_N: U3.17(TX1p) ; port MUX IN TX1_P
UFP_TX1b_P: U3.16(TX1n) ; port MUX IN TX1_N
UFP_TX2b_N: U3.20(TX2n) ; port MUX IN TX2_N
UFP_TX2b_P: U3.21(TX2p) ; port MUX IN TX2_P
NetD11_2: U3.25(SDA/OUT1) ; port OUT1
NetD12_2: U3.26(SCL/OUT2) ; port OUT2
NetR11_1: R11.1 U3.11(DIR)
NetR12_1: R12.1 U3.5(VBUS_DET)

Not connected (* = marked no-connect by the designer): U3 3(CURRENT_MODE)* 22(ADDR)* 23(~{INT}/OUT3)* 24(~{VCONN_FAULT})* 27(ID)*

### Notes on the sheet
- OUT1:
- H – Default (900 mA) current mode detected
- L – Medium (1.5 A) or High (3 A) Current Mode detected
- PORT: Pull low to enable UFP mode
- OUT2:
- H – Default or Medium current mode detected
- L – High current mode detected
- ADDR: Float to enable GPIO mode

### Library data of the parts
C20-C23 = CC0805KKX7R8BB105: as C37 on sheet LAN; Category: Capacitor; Manufacturer: Yageo; Manufacturer Part Number: CC0805KKX7R8BB105; Package: 0805; Value: 1uF; Supplier Part Number 1: 1458903; Supplier 1: Farnell; ComponentLink1URL: http://www.yageo.com; ComponentLink1Description: Manufacturer Website; Supplier 2: Digi-Key; Supplier Part Number 2: 311-1456-1-ND
R11 = RC0603FR-07220KL: RES 220K SM0603 YAGEO RC_L; Power (Watts): 0.1; Resistance (Ohms): 220000; Tolerance (%): 1; Category: Resistor; Manufacturer: Yageo; Manufacturer Part Number: RC0603FR-07220KL; Package: 0603; Value: 220K; Supplier Part Number 1: 9238760; Supplier 1: Farnell; ComponentLink1URL: http://www.yageo.com; ComponentLink1Description: Manufacturer Website; Supplier 2: Digi-Key; Supplier Part Number 2: 311-220KHRCT-ND
R12 = RC0603FR-07909KL: RES 909K SM0603 YAGEO RC_L; Power (Watts): 0.1; Resistance (Ohms): 909000; Tolerance (%): 1; Category: Resistor; Manufacturer: Yageo; Manufacturer Part Number: RC0603FR-07909KL; Package: 0603; Value: 909K; ComponentLink1URL: http://www.yageo.com; ComponentLink1Description: Manufacturer Website; Supplier 2: Digi-Key; Supplier Part Number 2: 311-909KHRCT-ND
U3 = HD3SS3220IRNHT: USB TYPE-C DRP PORT CONTROLLER W

## Sheet USB C Filter.SchDoc
size B
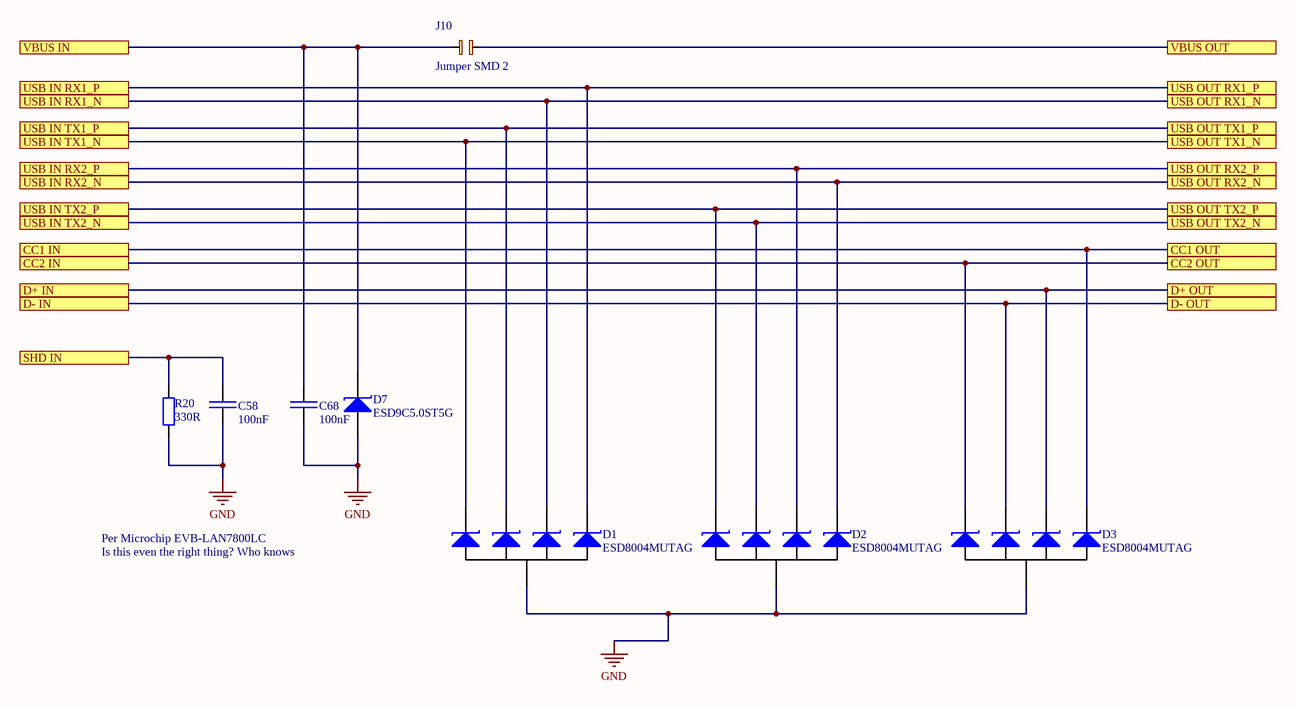
[diagram p5: USB C Filter.SchDoc]

### Parts
C58  100nF  [CAP_SM0603_YAGEOCC2_N]
C68  100nF  [CAP_SM0603_YAGEOCC2_N]
D1  ESD8004MUTAG  [ESD8004MUTAG]
D2  ESD8004MUTAG  [ESD8004MUTAG]
D3  ESD8004MUTAG  [ESD8004MUTAG]
D7  ESD9C5.0ST5G  [SODFL100X40-2N - ESD9C5.0ST5G]
J10  Jumper SMD 2  [Jumper SMD 2]
R20  330R  [RES_SM0603_YAGEORC_N]

### Ports
CC1 IN, CC1 OUT, CC2 IN, CC2 OUT, D+ IN, D+ OUT, D- IN, D- OUT, SHD IN, USB IN RX1_N, USB IN RX1_P, USB IN RX2_N, USB IN RX2_P, USB IN TX1_N, USB IN TX1_P, USB IN TX2_N, USB IN TX2_P, USB OUT RX1_N, USB OUT RX1_P, USB OUT RX2_N, USB OUT RX2_P, USB OUT TX1_N, USB OUT TX1_P, USB OUT TX2_N, USB OUT TX2_P, VBUS IN, VBUS OUT

### Nets
GND: C58.2 C68.2 D1.GND(A) D2.GND(A) D3.GND(A) D7.2 R20.1
VBUS: J10.1 ; port VBUS OUT
CC1: D3.5(K) ; port CC1 IN, port CC1 OUT
CC2: D3.1(K) ; port CC2 IN, port CC2 OUT
MUX SHD: C58.1 R20.2 ; port SHD IN
UFP_D_N: D3.2(K) ; port D- IN, port D- OUT
UFP_D_P: D3.4(K) ; port D+ IN, port D+ OUT
UFP_RX1_N: D1.4(K) ; port USB IN RX1_N, port USB OUT RX1_N
UFP_RX1_P: D1.5(K) ; port USB IN RX1_P, port USB OUT RX1_P
UFP_RX2_N: D2.5(K) ; port USB IN RX2_N, port USB OUT RX2_N
UFP_RX2_P: D2.4(K) ; port USB IN RX2_P, port USB OUT RX2_P
UFP_TX1_N: D1.1(K) ; port USB IN TX1_N, port USB OUT TX1_N
UFP_TX1_P: D1.2(K) ; port USB IN TX1_P, port USB OUT TX1_P
UFP_TX2_N: D2.2(K) ; port USB IN TX2_N, port USB OUT TX2_N
UFP_TX2_P: D2.1(K) ; port USB IN TX2_P, port USB OUT TX2_P
VBUS IN: C68.1 D7.1(K) J10.2 ; port VBUS IN

### Notes on the sheet
- Per Microchip EVB-LAN7800LC
- Is this even the right thing? Who knows

### Library data of the parts
C58 C68 = CC0603KRX7R9BB104: as C1 on sheet Hub; Category: Capacitor; Manufacturer: Yageo; Manufacturer Part Number: CC0603KRX7R9BB104; Package: 0603; Value: 100nF; Supplier Part Number 1: 1362556; Supplier 1: Farnell; ComponentLink1URL: http://www.yageo.com; ComponentLink1Description: Manufacturer Website; Supplier 2: Digi-Key; Supplier Part Number 2: 311-1344-1-ND
D1-D3 = ESD8004MUTAG: TVS DIODE 3.3VWM 8VC 10UDFN
D7 = ESD9C5.0ST5G: TVS DIODE 5VWM SOD923
R20 = RC0603FR-07330RL: RES 330R SM0603 YAGEO RC_L; Power (Watts): 0.1; Resistance (Ohms): 330; Tolerance (%): 1; Category: Resistor; Manufacturer: Yageo; Manufacturer Part Number: RC0603FR-07330RL; Package: 0603; Value: 330R; Supplier Part Number 1: 9238425; Supplier 1: Farnell; ComponentLink1URL: http://www.yageo.com; ComponentLink1Description: Manufacturer Website; Supplier 2: Digi-Key; Supplier Part Number 2: 311-330HRCT-ND

## Sheet USB A Filter.SchDoc
size B
Used 3 times, as channels AF2, AF3, AF4. Parts and nets are listed once, with the designators drawn on the sheet.
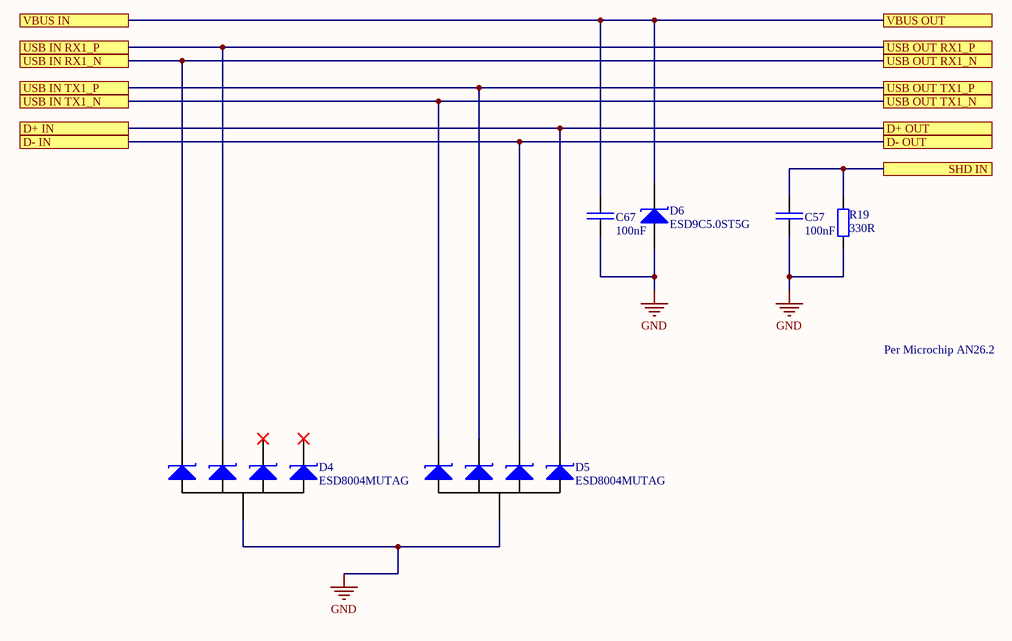
[diagram p6: USB A Filter.SchDoc]

### Parts
C57  100nF  [CAP_SM0603_YAGEOCC2_N]
C67  100nF  [CAP_SM0603_YAGEOCC2_N]
D4  ESD8004MUTAG  [ESD8004MUTAG]
D5  ESD8004MUTAG  [ESD8004MUTAG]
D6  ESD9C5.0ST5G  [SODFL100X40-2N - ESD9C5.0ST5G]
R19  330R  [RES_SM0603_YAGEORC_N]

### Ports
D+ IN, D+ OUT, D- IN, D- OUT, SHD IN, USB IN RX1_N, USB IN RX1_P, USB IN TX1_N, USB IN TX1_P, USB OUT RX1_N, USB OUT RX1_P, USB OUT TX1_N, USB OUT TX1_P, VBUS IN, VBUS OUT

### Nets
GND: C57.2 C67.2 D4.GND(A) D5.GND(A) D6.2 R19.1
D+ IN: D5.5(K) ; port D+ IN, port D+ OUT
D- IN: D5.4(K) ; port D- IN, port D- OUT
SHD IN: C57.1 R19.2 ; port SHD IN
USB IN RX1_N: D4.1(K) ; port USB IN RX1_N, port USB OUT RX1_N
USB IN RX1_P: D4.2(K) ; port USB IN RX1_P, port USB OUT RX1_P
USB IN TX1_N: D5.1(K) ; port USB IN TX1_N, port USB OUT TX1_N
USB IN TX1_P: D5.2(K) ; port USB IN TX1_P, port USB OUT TX1_P
VBUS IN: C67.1 D6.1(K) ; port VBUS IN, port VBUS OUT

Not connected (* = marked no-connect by the designer): D4 4(K)* 5(K)*

### Channels
AF2: designators end in _AF2; ports D+ IN=DFP2_D_P D+ OUT=DFP2_D_P D- IN=DFP2_D_N D- OUT=DFP2_D_N SHD IN=NetC57_AF2_1 USB IN RX1_N=DFP2_RX_N USB IN RX1_P=DFP2_RX_P USB IN TX1_N=DFP2_TXb_N USB IN TX1_P=DFP2_TXb_P USB OUT RX1_N=DFP2_RX_N USB OUT RX1_P=DFP2_RX_P USB OUT TX1_N=DFP2_TXb_N USB OUT TX1_P=DFP2_TXb_P VBUS IN=VBUS2 VBUS OUT=VBUS2
AF3: designators end in _AF3; ports D+ IN=DFP3_D_P D+ OUT=DFP3_D_P D- IN=DFP3_D_N D- OUT=DFP3_D_N SHD IN=NetC57_AF3_1 USB IN RX1_N=DFP3_RX_N USB IN RX1_P=DFP3_RX_P USB IN TX1_N=DFP3_TXb_N USB IN TX1_P=DFP3_TXb_P USB OUT RX1_N=DFP3_RX_N USB OUT RX1_P=DFP3_RX_P USB OUT TX1_N=DFP3_TXb_N USB OUT TX1_P=DFP3_TXb_P VBUS IN=VBUS3 VBUS OUT=VBUS3
AF4: designators end in _AF4; ports D+ IN=DFP4_D_P D+ OUT=DFP4_D_P D- IN=DFP4_D_N D- OUT=DFP4_D_N SHD IN=NetC57_AF4_1 USB IN RX1_N=DFP4_RX_N USB IN RX1_P=DFP4_RX_P USB IN TX1_N=DFP4_TXb_N USB IN TX1_P=DFP4_TXb_P USB OUT RX1_N=DFP4_RX_N USB OUT RX1_P=DFP4_RX_P USB OUT TX1_N=DFP4_TXb_N USB OUT TX1_P=DFP4_TXb_P VBUS IN=VBUS4 VBUS OUT=VBUS4

### Notes on the sheet
- Per Microchip AN26.2

### Library data of the parts
C57 C67 = CC0603KRX7R9BB104: as C1 on sheet Hub; Category: Capacitor; Manufacturer: Yageo; Manufacturer Part Number: CC0603KRX7R9BB104; Package: 0603; Value: 100nF; Supplier Part Number 1: 1362556; Supplier 1: Farnell; ComponentLink1URL: http://www.yageo.com; ComponentLink1Description: Manufacturer Website; Supplier 2: Digi-Key; Supplier Part Number 2: 311-1344-1-ND
D4 D5 = ESD8004MUTAG: TVS DIODE 3.3VWM 8VC 10UDFN
D6 = ESD9C5.0ST5G: TVS DIODE 5VWM SOD923
R19 = RC0603FR-07330RL: as R20 on sheet USB C Filter; Category: Resistor; Manufacturer: Yageo; Manufacturer Part Number: RC0603FR-07330RL; Package: 0603; Value: 330R; Supplier Part Number 1: 9238425; Supplier 1: Farnell; ComponentLink1URL: http://www.yageo.com; ComponentLink1Description: Manufacturer Website; Supplier 2: Digi-Key; Supplier Part Number 2: 311-330HRCT-ND

## Sheet Load Switch.SchDoc
size B
Used 3 times, as channels LS2, LS3, LS4. Parts and nets are listed once, with the designators drawn on the sheet.
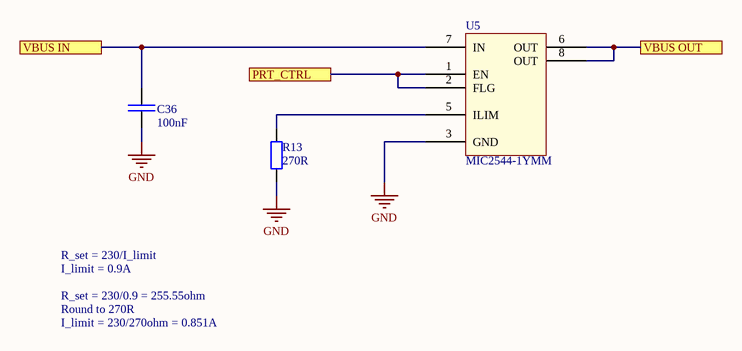
[diagram p7: Load Switch.SchDoc]

### Parts
C36  100nF  [CAP_SM0603_YAGEOCC2_N]
R13  270R  [RES_SM0603_YAGEORC_N]
U5  MIC2544-1YMM  [TSOP65P490X110-8N - MIC2544-1YMM]

### Ports
PRT_CTRL, VBUS IN, VBUS OUT

### Nets
GND: C36.2 R13.1 U5.3(GND)
PRT_CTRL: U5.1(EN) U5.2(FLG) ; port PRT_CTRL
VBUS IN: C36.1 U5.7(IN) ; port VBUS IN
VBUS OUT: U5.6(OUT) U5.8(OUT) ; port VBUS OUT
NetR13_2: R13.2 U5.5(ILIM)

### Channels
LS2: designators end in _LS2; ports PRT_CTRL=DFP PCTL2 VBUS IN=VBUS VBUS OUT=VBUS2
LS3: designators end in _LS3; ports PRT_CTRL=DFP PCTL3 VBUS IN=VBUS VBUS OUT=VBUS3
LS4: designators end in _LS4; ports PRT_CTRL=DFP PCTL4 VBUS IN=VBUS VBUS OUT=VBUS4

### Notes on the sheet
- R_set = 230/I_limit
- I_limit = 0.9A
- R_set = 230/0.9 = 255.55ohm
- I_limit = 230/270ohm = 0.851A
- Round to 270R

### Library data of the parts
C36 = CC0603KRX7R9BB104: as C1 on sheet Hub; Category: Capacitor; Manufacturer: Yageo; Manufacturer Part Number: CC0603KRX7R9BB104; Package: 0603; Value: 100nF; Supplier Part Number 1: 1362556; Supplier 1: Farnell; ComponentLink1URL: http://www.yageo.com; ComponentLink1Description: Manufacturer Website; Supplier 2: Digi-Key; Supplier Part Number 2: 311-1344-1-ND
R13 = RC0603FR-07270RL: RES 270R SM0603 YAGEO RC_L; Power (Watts): 0.1; Resistance (Ohms): 270; Tolerance (%): 1; Category: Resistor; Manufacturer: Yageo; Manufacturer Part Number: RC0603FR-07270RL; Package: 0603; Value: 270R; Supplier Part Number 1: 9238417; Supplier 1: Farnell; ComponentLink1URL: http://www.yageo.com; ComponentLink1Description: Manufacturer Website; Supplier 2: Digi-Key; Supplier Part Number 2: 311-270HRCT-ND
U5 = MIC2544-1YMM: IC PWR SWITCH N-CHAN 1:1 8MSOP

## Sheet Block Diagram and Notes.SchDoc
size B
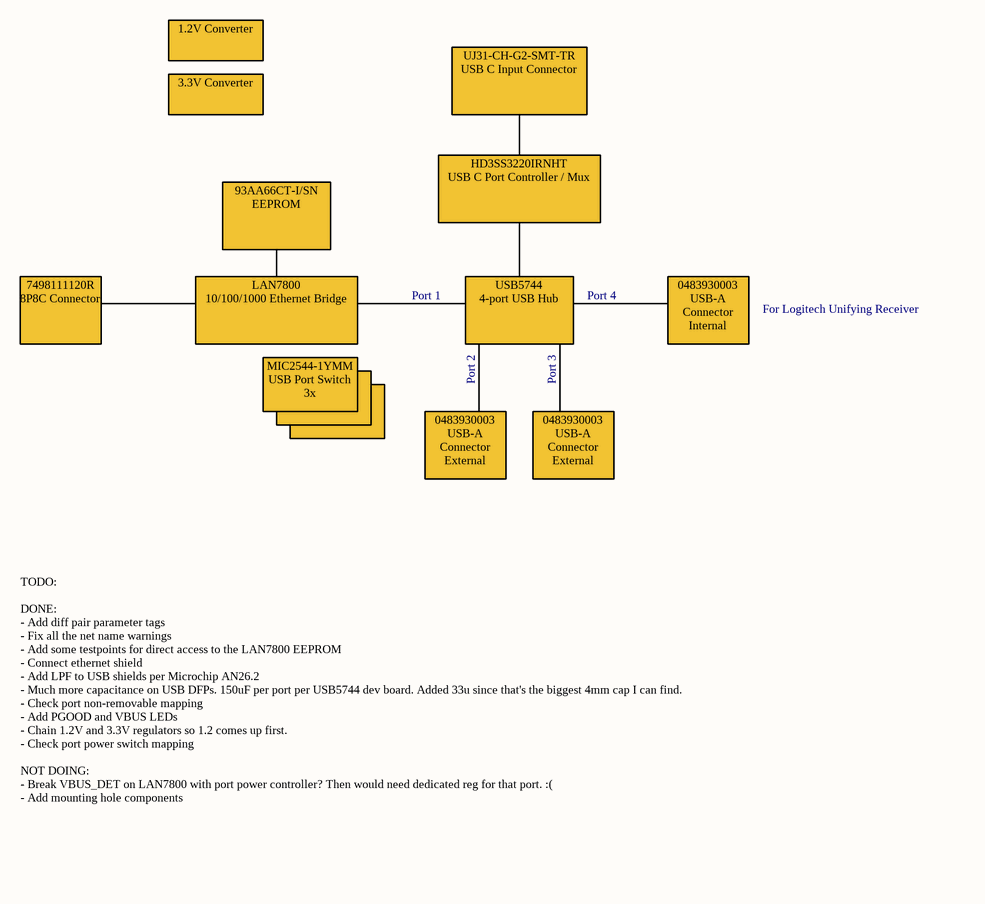
[diagram p8: Block Diagram and Notes.SchDoc]

### Notes on the sheet
- 1.2V Converter
- 3.3V Converter
- UJ31-CH-G2-SMT-TR
  USB C Input Connector
- 93AA66CT-I/SN
  EEPROM
- HD3SS3220IRNHT
  USB C Port Controller / Mux
- Port 1
- Port 4
- For Logitech Unifying Receiver
- 7498111120R
  8P8C Connector
- LAN7800
  10/100/1000 Ethernet Bridge
- USB5744
  4-port USB Hub
- Port 2
- Port 3
- 0483930003
  USB-A Connector
  Internal
- MIC2544-1YMM
  USB Port Switch
  3x
- 0483930003
  USB-A Connector
  External
- TODO:
  DONE:
  - Add diff pair parameter tags
  - Fix all the net name warnings
  - Add some testpoints for direct access to the LAN7800 EEPROM
  - Connect ethernet shield
  - Add LPF to USB shields per Microchip AN26.2
  - Much more capacitance on USB DFPs. 150uF per port per USB5744 dev board. Added 33u since that's the biggest 4mm cap I can find.
  - Check port non-removable mapping
  - Add PGOOD and VBUS LEDs
  - Chain 1.2V and 3.3V regulators so 1.2 comes up first.
  - Check port power switch mapping
  NOT DOING:
  - Break VBUS_DET on LAN7800 with port power controller? Then would need dedicated reg for that port. :(
  - Add mounting hole components

## Sheet Power.SchDoc
size B
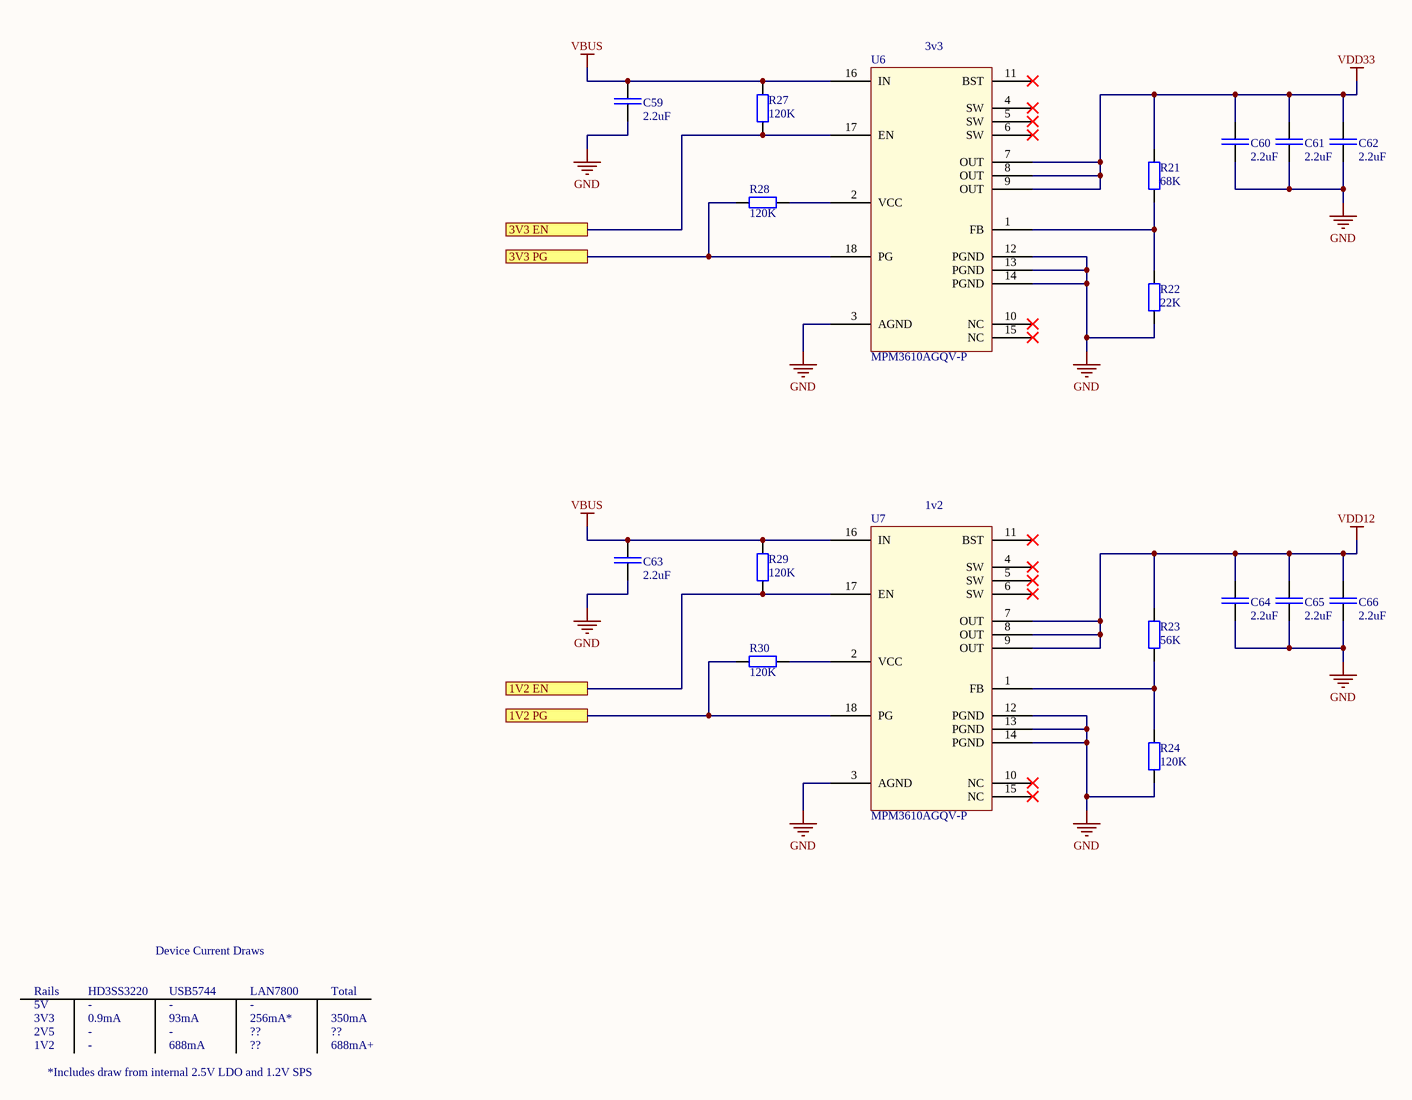
[diagram p9: Power.SchDoc]

### Parts
C59  2.2uF  [CAP_SM0805_YAGEOCC2_N]
C60  2.2uF  [CAP_SM0805_YAGEOCC2_N]
C61  2.2uF  [CAP_SM0805_YAGEOCC2_N]
C62  2.2uF  [CAP_SM0805_YAGEOCC2_N]
C63  2.2uF  [CAP_SM0805_YAGEOCC2_N]
C64  2.2uF  [CAP_SM0805_YAGEOCC2_N]
C65  2.2uF  [CAP_SM0805_YAGEOCC2_N]
C66  2.2uF  [CAP_SM0805_YAGEOCC2_N]
R21  68K  [RES_SM0603_YAGEORC_N]
R22  22K  [RES_SM0603_YAGEORC_N]
R23  56K  [RES_SM0603_YAGEORC_N]
R24  120K  [RES_SM0603_YAGEORC_N]
R27  120K  [RES_SM0603_YAGEORC_N]
R28  120K  [RES_SM0603_YAGEORC_N]
R29  120K  [RES_SM0603_YAGEORC_N]
R30  120K  [RES_SM0603_YAGEORC_N]
U6  MPM3610AGQV-P  [MPM3610AGQV-P]
U7  MPM3610AGQV-P  [MPM3610AGQV-P]

### Ports
1V2 EN, 1V2 PG, 3V3 EN, 3V3 PG

### Nets
GND: C59.2 C60.2 C61.2 C62.2 C63.2 C64.2 C65.2 C66.2 R22.1 R24.1 U6.3(AGND) U6.12(PGND) U6.13(PGND) U6.14(PGND) U7.3(AGND) U7.12(PGND) U7.13(PGND) U7.14(PGND)
VBUS: C59.1 C63.1 R27.1 R29.1 U6.16(IN) U7.16(IN)
VDD12: C64.1 C65.1 C66.1 R23.2 U7.7(OUT) U7.8(OUT) U7.9(OUT)
VDD33: C60.1 C61.1 C62.1 R21.2 U6.7(OUT) U6.8(OUT) U6.9(OUT)
NetR21_1: R21.1 R22.2 U6.1(FB)
NetR23_1: R23.1 R24.2 U7.1(FB)
NetR27_2: R27.2 R30.2 U6.17(EN) U7.18(PG) ; port 3V3 EN, port 1V2 PG
NetR28_1: R28.1 U6.2(VCC)
NetR28_2: R28.2 U6.18(PG) ; port 3V3 PG
NetR29_2: R29.2 U7.17(EN) ; port 1V2 EN
NetR30_1: R30.1 U7.2(VCC)

Not connected (* = marked no-connect by the designer): U6 4(SW)* 5(SW)* 6(SW)* 10(NC)* 11(BST)* 15(NC)*; U7 4(SW)* 5(SW)* 6(SW)* 10(NC)* 11(BST)* 15(NC)*

### Notes on the sheet
- (near U6) 3v3
- (near U7) 1v2
- Device Current Draws
- Rails
- 3V3
- 1V2
- 2V5
- 5V
- HD3SS3220
- 0.9mA
- -
- USB5744
- 93mA
- 688mA
- LAN7800
- 256mA*
- ??
- Total
- 350mA
- 688mA+
- *Includes draw from internal 2.5V LDO and 1.2V SPS

### Library data of the parts
C59-C66 = CC0805KKX7R8BB225: CAP 2u2F SM0805 X7R 25V YAGEO CC2; Tolerance (%): 10; Voltage Rating (Volts): 25; Category: Capacitor; Manufacturer: Yageo; Manufacturer Part Number: CC0805KKX7R8BB225; Package: 0805; Value: 2.2uF; Supplier Part Number 1: 1458904; Supplier 1: Farnell; ComponentLink1URL: http://www.yageo.com; ComponentLink1Description: Manufacturer Website; Supplier 2: Digi-Key
R21 = RC0603FR-0768KL: RES 68K SM0603 YAGEO RC_L; Power (Watts): 0.1; Resistance (Ohms): 68000; Tolerance (%): 1; Category: Resistor; Manufacturer: Yageo; Manufacturer Part Number: RC0603FR-0768KL; Package: 0603; Value: 68K; Supplier Part Number 1: 9238700; Supplier 1: Farnell; ComponentLink1URL: http://www.yageo.com; ComponentLink1Description: Manufacturer Website; Supplier 2: Digi-Key; Supplier Part Number 2: 311-68.0KHRCT-ND
R22 = RC0603FR-0722KL: RES 22K SM0603 YAGEO RC_L; Power (Watts): 0.1; Resistance (Ohms): 22000; Tolerance (%): 1; Category: Resistor; Manufacturer: Yageo; Manufacturer Part Number: RC0603FR-0722KL; Package: 0603; Value: 22K; Supplier Part Number 1: 9238646; Supplier 1: Farnell; ComponentLink1URL: http://www.yageo.com; ComponentLink1Description: Manufacturer Website; Supplier 2: Digi-Key; Supplier Part Number 2: 311-22.0KHRCT-ND
R23 = RC0603FR-0756KL: RES 56K SM0603 YAGEO RC_L; Power (Watts): 0.1; Resistance (Ohms): 56000; Tolerance (%): 1; Category: Resistor; Manufacturer: Yageo; Manufacturer Part Number: RC0603FR-0756KL; Package: 0603; Value: 56K; Supplier Part Number 1: 9238697; Supplier 1: Farnell; ComponentLink1URL: http://www.yageo.com; ComponentLink1Description: Manufacturer Website; Supplier 2: Digi-Key; Supplier Part Number 2: 311-56KHRCT-ND
R24 R27-R30 = RC0603FR-07120KL: RES 120K SM0603 YAGEO RC_L; Power (Watts): 0.1; Resistance (Ohms): 120000; Tolerance (%): 1; Category: Resistor; Manufacturer: Yageo; Manufacturer Part Number: RC0603FR-07120KL; Package: 0603; Value: 120K; Supplier Part Number 1: 9238735; Supplier 1: Farnell; ComponentLink1URL: http://www.yageo.com; ComponentLink1Description: Manufacturer Website; Supplier 2: Digi-Key; Supplier Part Number 2: 311-120KHRCT-ND
U6 U7 = MPM3610AGQV-P: DC DC CONVERTER 0.8-18.48V

## Nets that join several sheets
GND: Top Level (18 pins), Hub (21 pins), LAN (28 pins), MUX (10 pins), USB C Filter (7 pins), AF2 (6 pins), AF3 (6 pins), AF4 (6 pins), LS2 (C36_LS2.2 R13_LS2.1 U5_LS2.3), LS3 (C36_LS3.2 R13_LS3.1 U5_LS3.3), LS4 (C36_LS4.2 R13_LS4.1 U5_LS4.3), Power (18 pins)
VBUS: Top Level (J6.1 R31.1 R34.1 R35.1), Hub (R5.2), MUX (C20.1 C21.1 R12.2 U3.30), USB C Filter (J10.1), LS2 (C36_LS2.1 U5_LS2.7), LS3 (C36_LS3.1 U5_LS3.7), LS4 (C36_LS4.1 U5_LS4.7), Power (6 pins)
VDD12: Top Level (J8.1), Hub (16 pins), LAN (9 pins), Power (7 pins)
VDD33: Top Level (J7.1), Hub (12 pins), LAN (16 pins), MUX (C22.1 C23.1 R11.2 U3.8), Power (7 pins)
CC1: Top Level (J2.A5), MUX (U3.2), USB C Filter (D3.5)
CC2: Top Level (J2.B5), MUX (U3.1), USB C Filter (D3.1)
DFP1_D_N: Hub (U1.2), LAN (U2.27)
DFP1_D_P: Hub (U1.1), LAN (U2.26)
DFP1_RXa_N: Top Level (C56.1), Hub (U1.7)
DFP1_RXa_P: Top Level (C55.1), Hub (U1.6)
DFP1_RXb_N: Top Level (C56.2), LAN (U2.28)
DFP1_RXb_P: Top Level (C55.2), LAN (U2.29)
DFP1_TXa_N: Top Level (C26.1), Hub (U1.4)
DFP1_TXa_P: Top Level (C24.1), Hub (U1.3)
DFP1_TXb_N: Top Level (C26.2), LAN (U2.31)
DFP1_TXb_P: Top Level (C24.2), LAN (U2.32)
DFP2_D_N: Top Level (J3.2), Hub (U1.9), AF2 (D5_AF2.4)
DFP2_D_P: Top Level (J3.3), Hub (U1.8), AF2 (D5_AF2.5)
DFP2_RX_N: Top Level (J3.5), Hub (U1.14), AF2 (D4_AF2.1)
DFP2_RX_P: Top Level (J3.6), Hub (U1.13), AF2 (D4_AF2.2)
DFP2_TXa_N: Top Level (C29.1), Hub (U1.11)
DFP2_TXa_P: Top Level (C28.1), Hub (U1.10)
DFP2_TXb_N: Top Level (C29.2 J3.8), AF2 (D5_AF2.1)
DFP2_TXb_P: Top Level (C28.2 J3.9), AF2 (D5_AF2.2)
DFP3_D_N: Top Level (J4.2), Hub (U1.18), AF3 (D5_AF3.4)
DFP3_D_P: Top Level (J4.3), Hub (U1.17), AF3 (D5_AF3.5)
DFP3_RX_N: Top Level (J4.5), Hub (U1.23), AF3 (D4_AF3.1)
DFP3_RX_P: Top Level (J4.6), Hub (U1.22), AF3 (D4_AF3.2)
DFP3_TXa_N: Top Level (C31.1), Hub (U1.20)
DFP3_TXa_P: Top Level (C30.1), Hub (U1.19)
DFP3_TXb_N: Top Level (C31.2 J4.8), AF3 (D5_AF3.1)
DFP3_TXb_P: Top Level (C30.2 J4.9), AF3 (D5_AF3.2)
DFP4_D_N: Top Level (J5.2), Hub (U1.25), AF4 (D5_AF4.4)
DFP4_D_P: Top Level (J5.3), Hub (U1.24), AF4 (D5_AF4.5)
DFP4_RX_N: Top Level (J5.5), Hub (U1.30), AF4 (D4_AF4.1)
DFP4_RX_P: Top Level (J5.6), Hub (U1.29), AF4 (D4_AF4.2)
DFP4_TXa_N: Top Level (C33.1), Hub (U1.27)
DFP4_TXa_P: Top Level (C32.1), Hub (U1.26)
DFP4_TXb_N: Top Level (C33.2 J5.8), AF4 (D5_AF4.1)
DFP4_TXb_P: Top Level (C32.2 J5.9), AF4 (D5_AF4.2)
DFP PCTL2: Hub (U1.35), LS2 (U5_LS2.1 U5_LS2.2)
DFP PCTL3: Hub (U1.34), LS3 (U5_LS3.1 U5_LS3.2)
DFP PCTL4: Hub (U1.32), LS4 (U5_LS4.1 U5_LS4.2)
DUPLEX LED3: Top Level (J1.13), LAN (U2.33)
LINK LED2: Top Level (J1.1), LAN (U2.24)
MUX SHD: Top Level (J2.SHD), USB C Filter (C58.1 R20.2)
MUX_RX_N: Hub (U1.51), MUX (U3.9)
MUX_RX_P: Hub (U1.50), MUX (U3.10)
MUX_TX_N: Hub (U1.48), MUX (U3.6)
MUX_TX_P: Hub (U1.47), MUX (U3.7)
NetC57_AF2_1: Top Level (J3.7 J3.SHD), AF2 (C57_AF2.1 R19_AF2.2)
NetC57_AF3_1: Top Level (J4.7 J4.SHD), AF3 (C57_AF3.1 R19_AF3.2)
NetC57_AF4_1: Top Level (J5.7 J5.SHD), AF4 (C57_AF4.1 R19_AF4.2)
NetD11_2: Top Level (D11.2), MUX (U3.25)
NetD12_2: Top Level (D12.2), MUX (U3.26)
NetR27_2: Top Level (R33.1), Power (R27.2 R30.2 U6.17 U7.18)
NetR28_2: Top Level (R32.1), Power (R28.2 U6.18)
TR0_N: Top Level (J1.4), LAN (U2.2)
TR0_P: Top Level (J1.3), LAN (U2.1)
TR1_N: Top Level (J1.6), LAN (U2.5)
TR1_P: Top Level (J1.5), LAN (U2.4)
TR2_N: Top Level (J1.8), LAN (U2.8)
TR2_P: Top Level (J1.7), LAN (U2.7)
TR3_N: Top Level (J1.10), LAN (U2.11)
TR3_P: Top Level (J1.9), LAN (U2.10)
UFP_D_N: Top Level (J2.A7 J2.B7), Hub (U1.46), USB C Filter (D3.2)
UFP_D_P: Top Level (J2.A6 J2.B6), Hub (U1.45), USB C Filter (D3.4)
UFP_RX1_N: Top Level (J2.B10), MUX (U3.15), USB C Filter (D1.4)
UFP_RX1_P: Top Level (J2.B11), MUX (U3.14), USB C Filter (D1.5)
UFP_RX2_N: Top Level (J2.A10), MUX (U3.18), USB C Filter (D2.5)
UFP_RX2_P: Top Level (J2.A11), MUX (U3.19), USB C Filter (D2.4)
UFP_TX1_N: Top Level (C27.1 J2.A3), USB C Filter (D1.1)
UFP_TX1_P: Top Level (C25.1 J2.A2), USB C Filter (D1.2)
UFP_TX1b_N: Top Level (C27.2), MUX (U3.17)
UFP_TX1b_P: Top Level (C25.2), MUX (U3.16)
UFP_TX2_N: Top Level (C70.1 J2.B3), USB C Filter (D2.2)
UFP_TX2_P: Top Level (C69.1 J2.B2), USB C Filter (D2.1)
UFP_TX2b_N: Top Level (C70.2), MUX (U3.20)
UFP_TX2b_P: Top Level (C69.2), MUX (U3.21)
VBUS2: Top Level (C72.1 J3.1), AF2 (C67_AF2.1 D6_AF2.1), LS2 (U5_LS2.6 U5_LS2.8)
VBUS3: Top Level (C73.1 J4.1), AF3 (C67_AF3.1 D6_AF3.1), LS3 (U5_LS3.6 U5_LS3.8)
VBUS4: Top Level (C74.1 J5.1), AF4 (C67_AF4.1 D6_AF4.1), LS4 (U5_LS4.6 U5_LS4.8)
VBUS IN: Top Level (J2.A4 J2.A9 J2.B4 J2.B9), USB C Filter (C68.1 D7.1 J10.2)